# EasyEDA Pro project Project-File_Cpeedo-mk5.epro, schematic Schematic1

## Sheets
1 Cellular: Board Name: Board1; Create Date: 2025-12-05; Page Name: Cellular; Project Name: Speedo_1; Schematic Name: Schematic1; Update Date: 2026-03-03; Company: EasyEDA.com; Page Size: A4; Version: V1.0
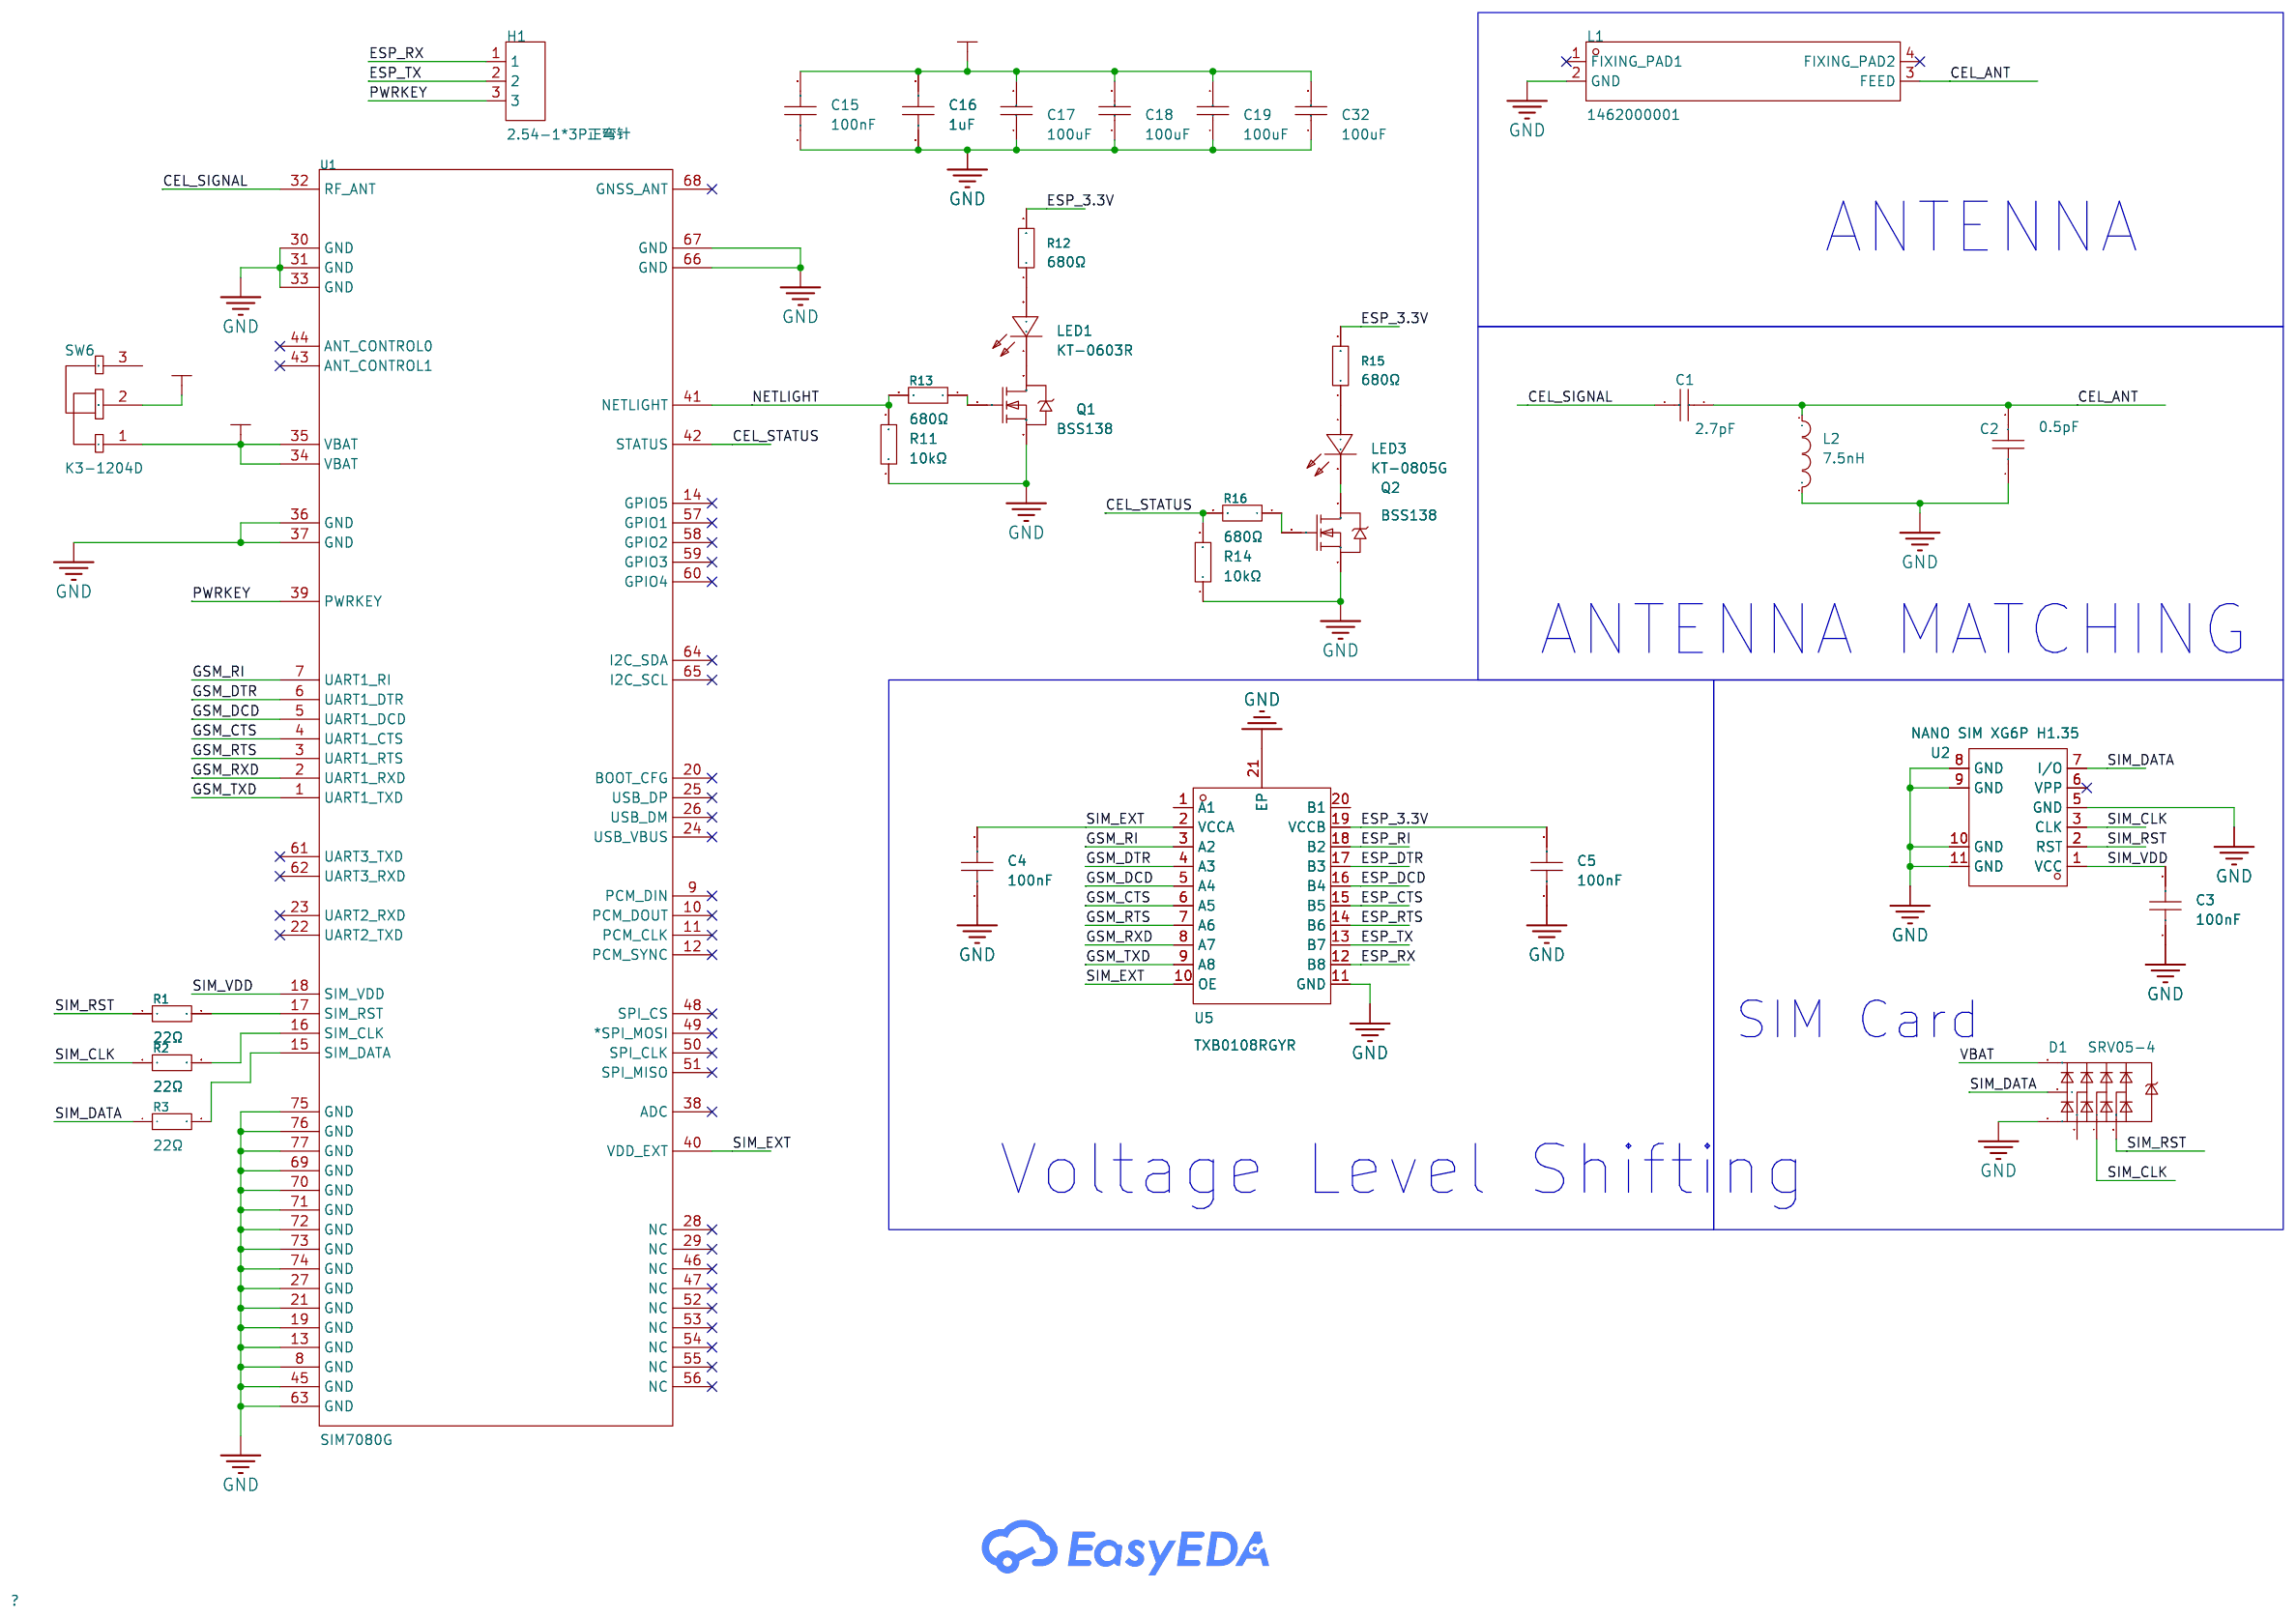
[diagram p0: Cellular]
2 STM32: Create Date: 2025-12-21; Page Name: STM32
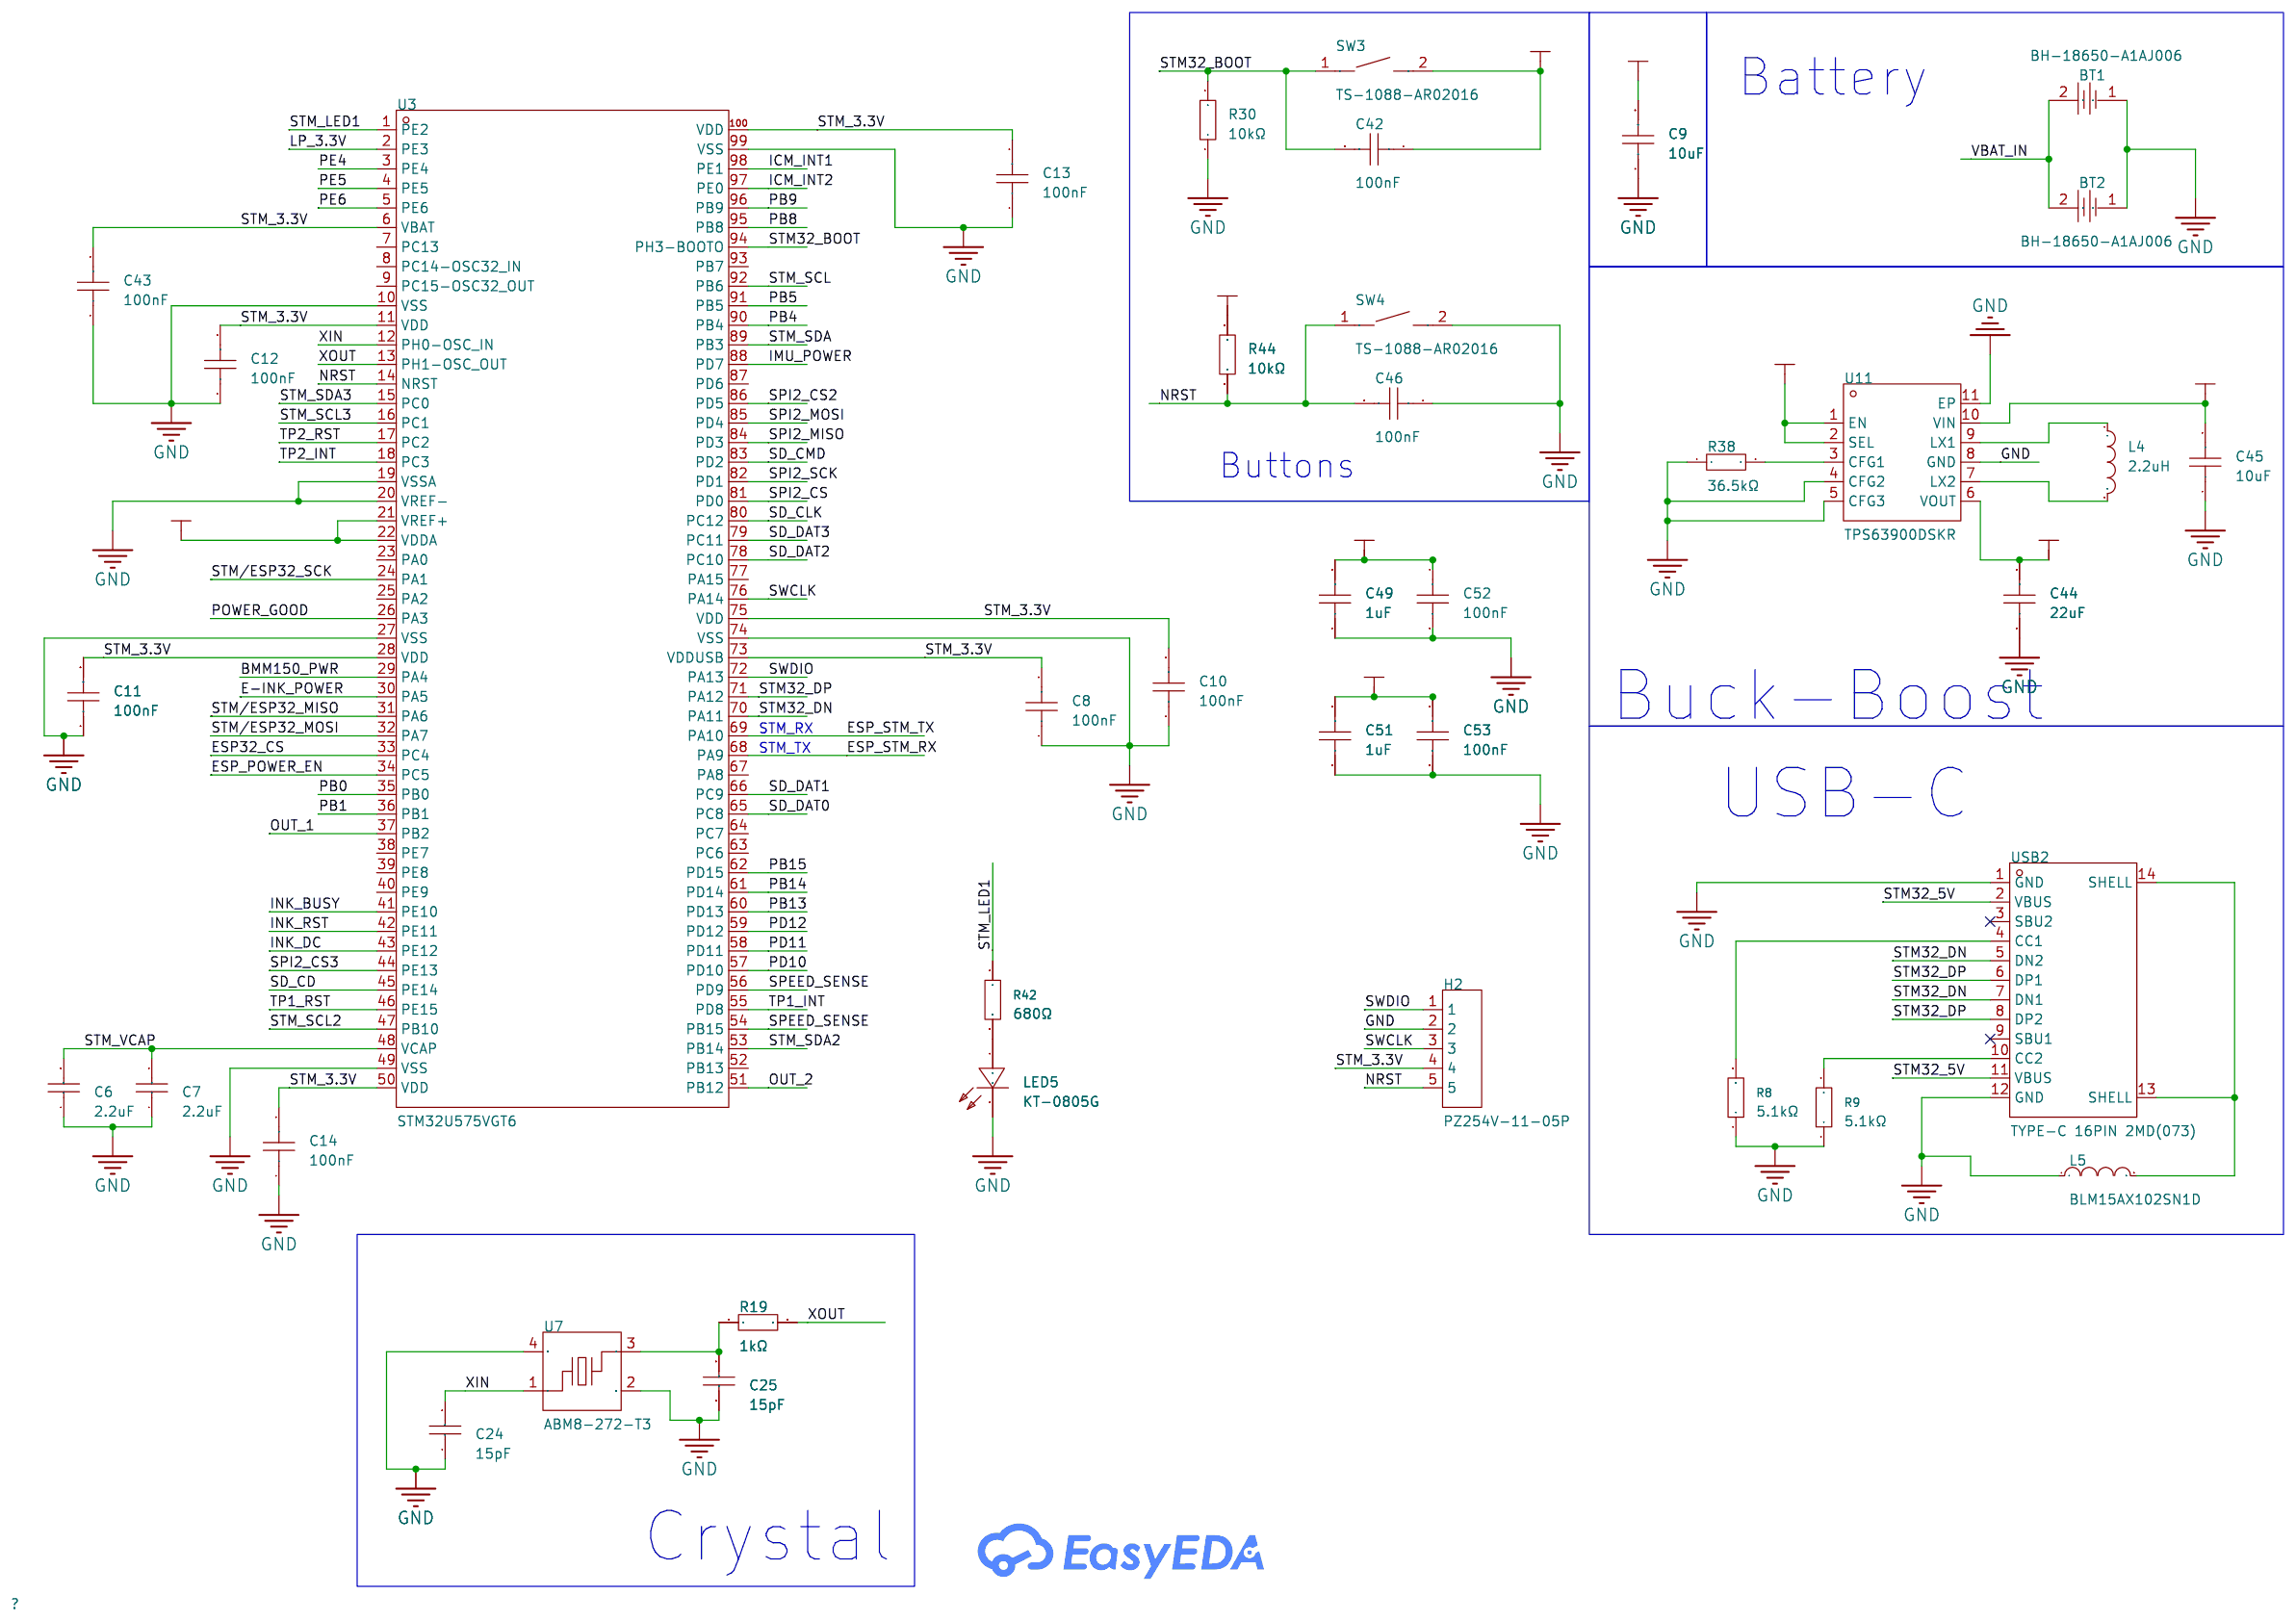
[diagram p1: STM32]
3 ESP32: Create Date: 2025-12-21; Page Name: ESP32; Update Date: 2026-03-02
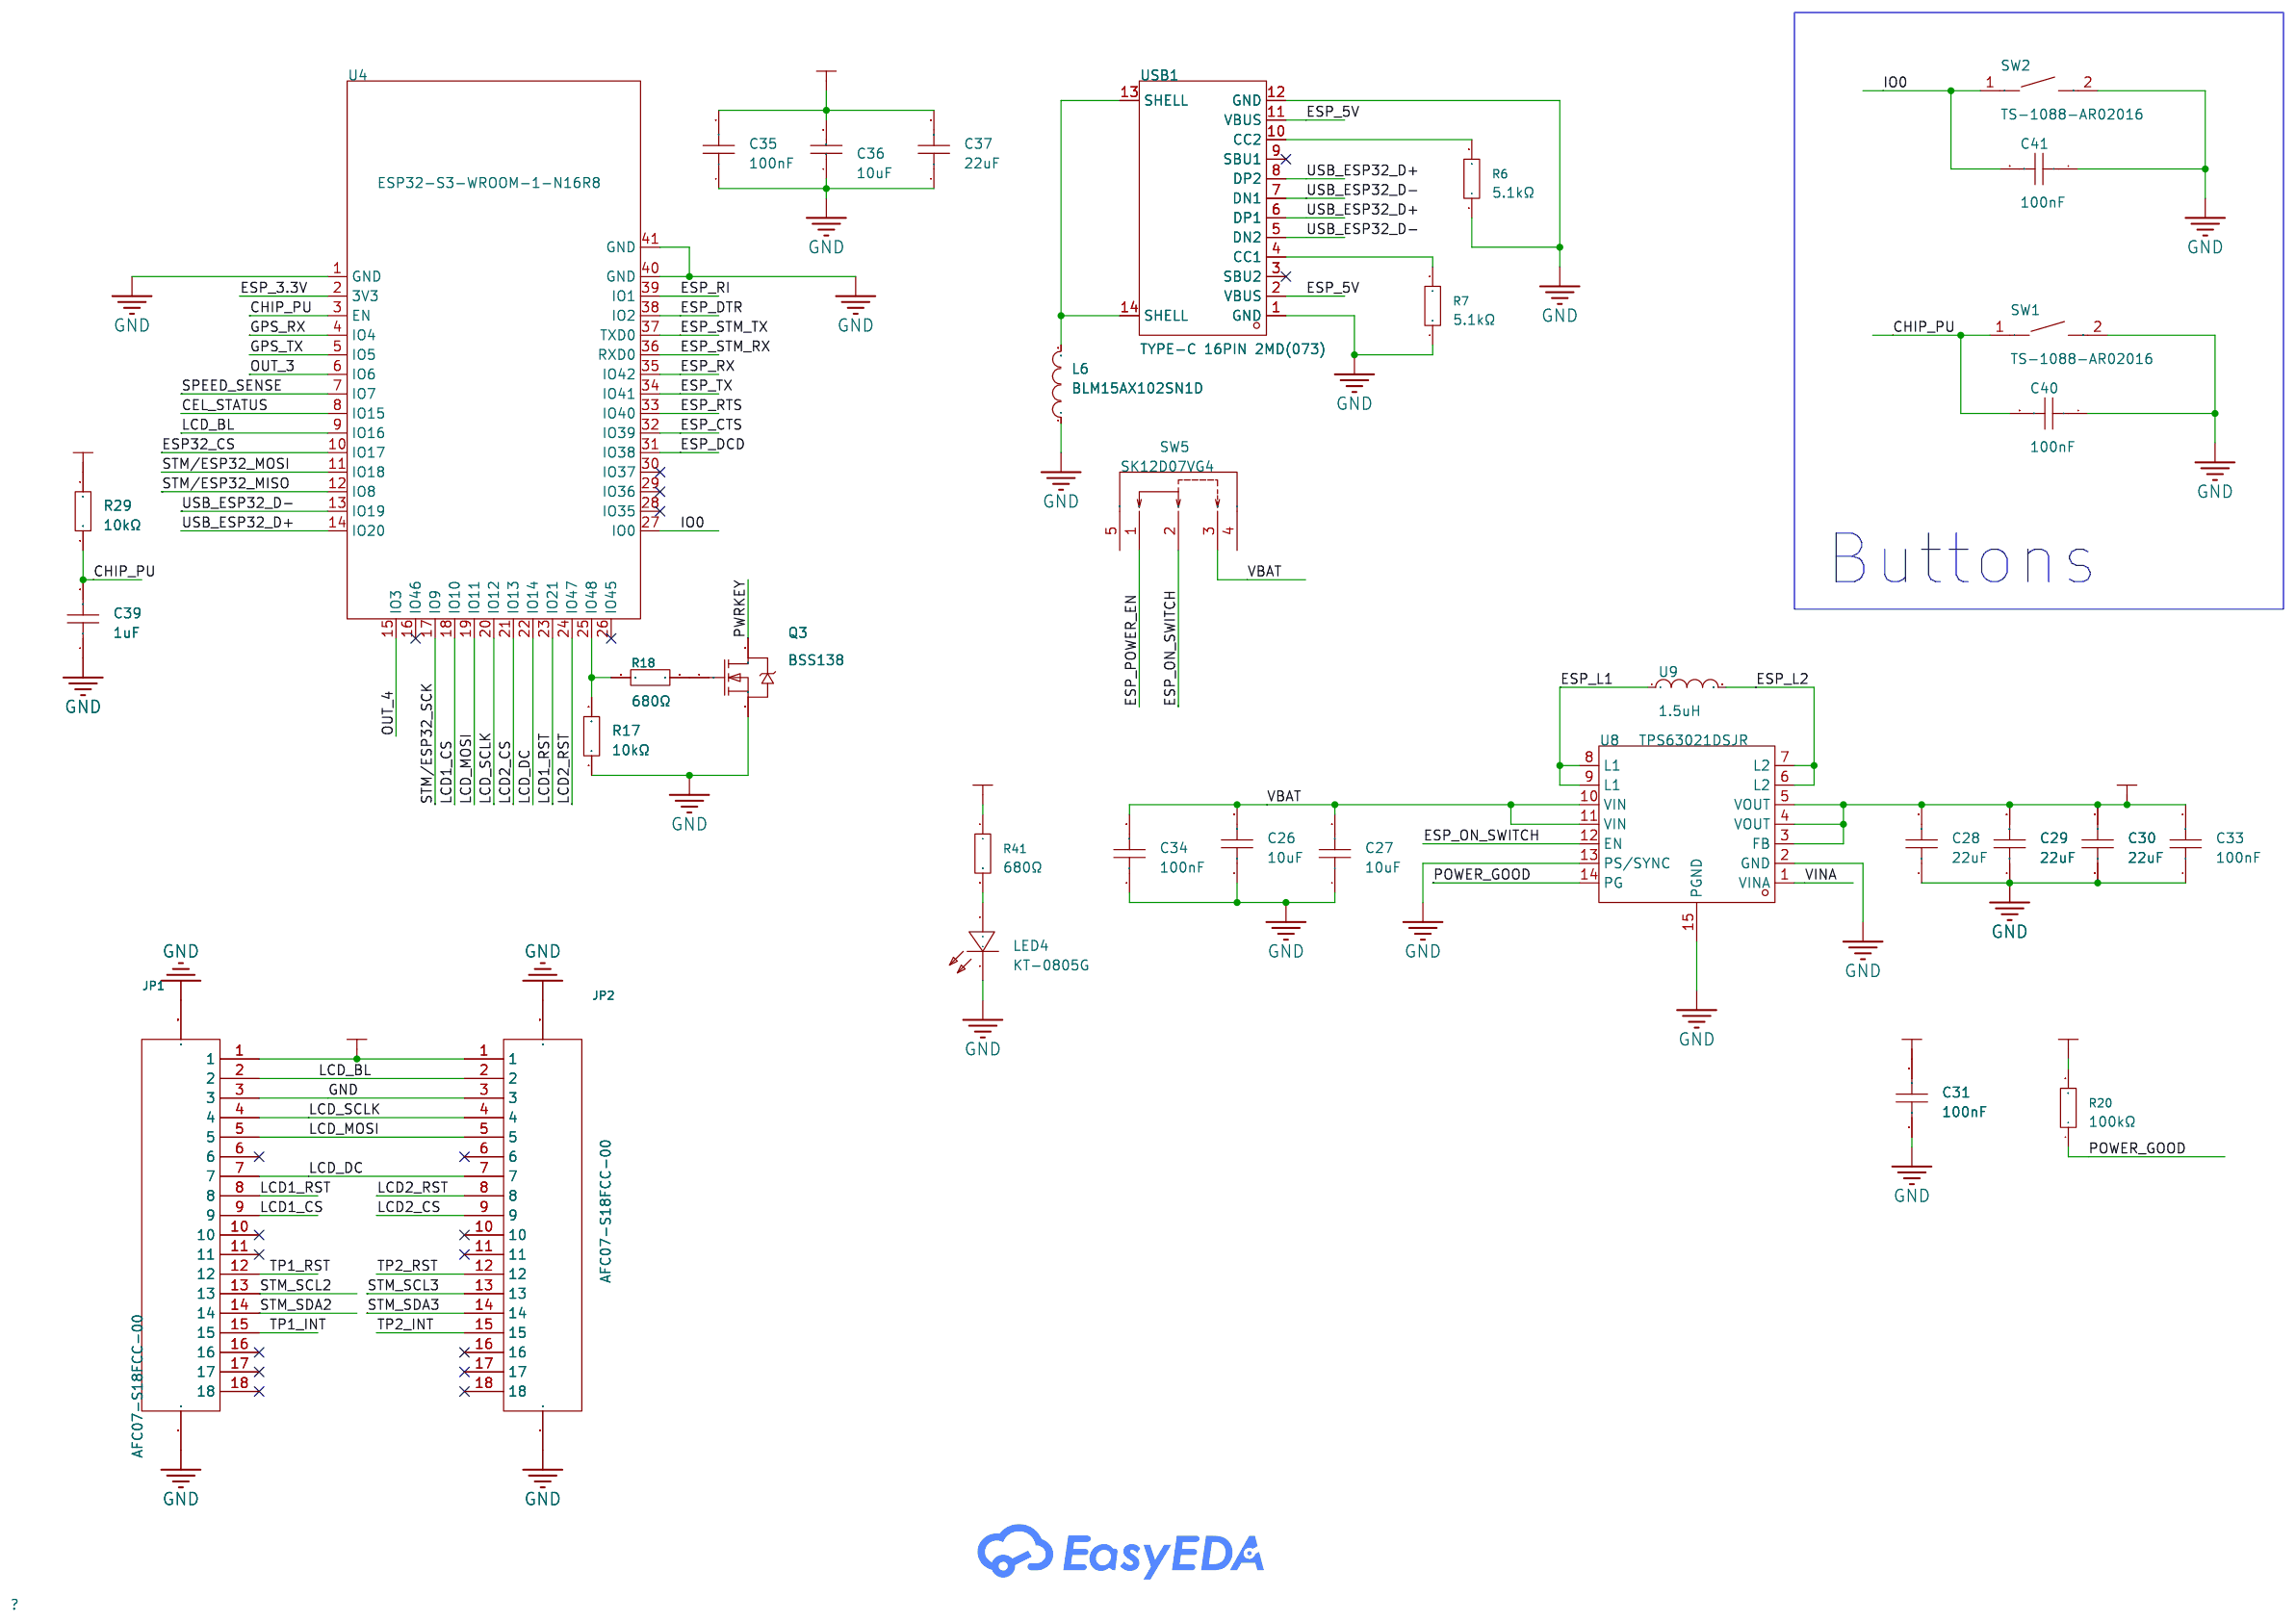
[diagram p2: ESP32]
4 GNSS / GPS: Create Date: 2025-12-22; Page Name: GNSS / GPS; Update Date: 2025-12-28
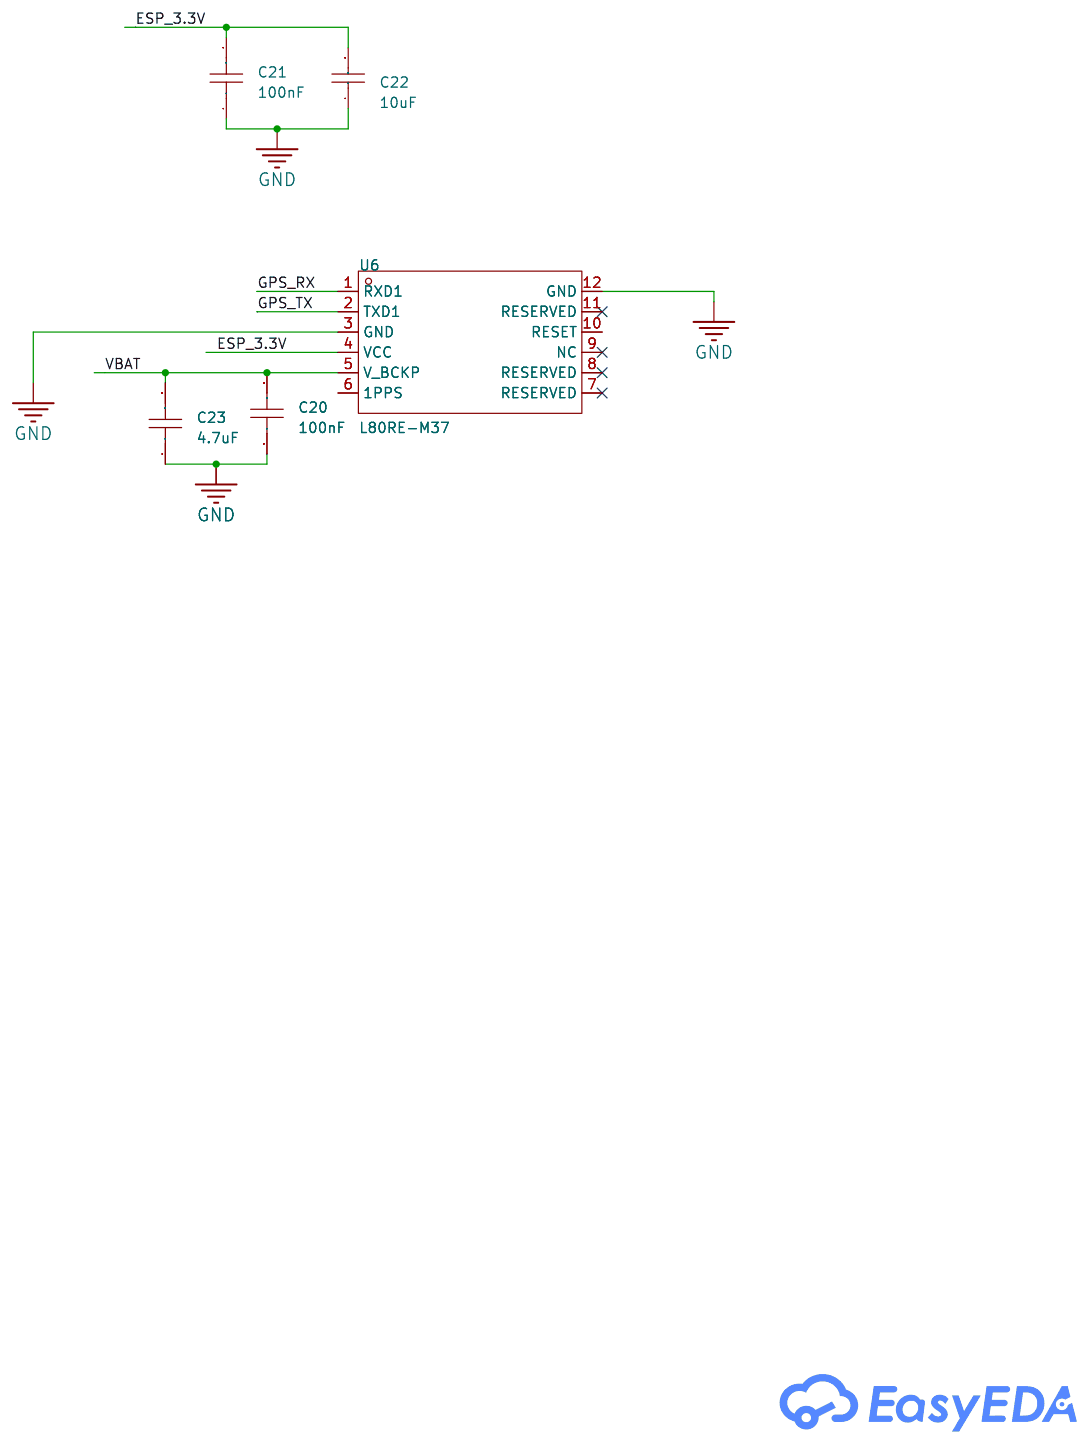
[diagram p3: GNSS / GPS]
5 STM32_Sensors: Create Date: 2025-12-24; Page Name: STM32_Sensors
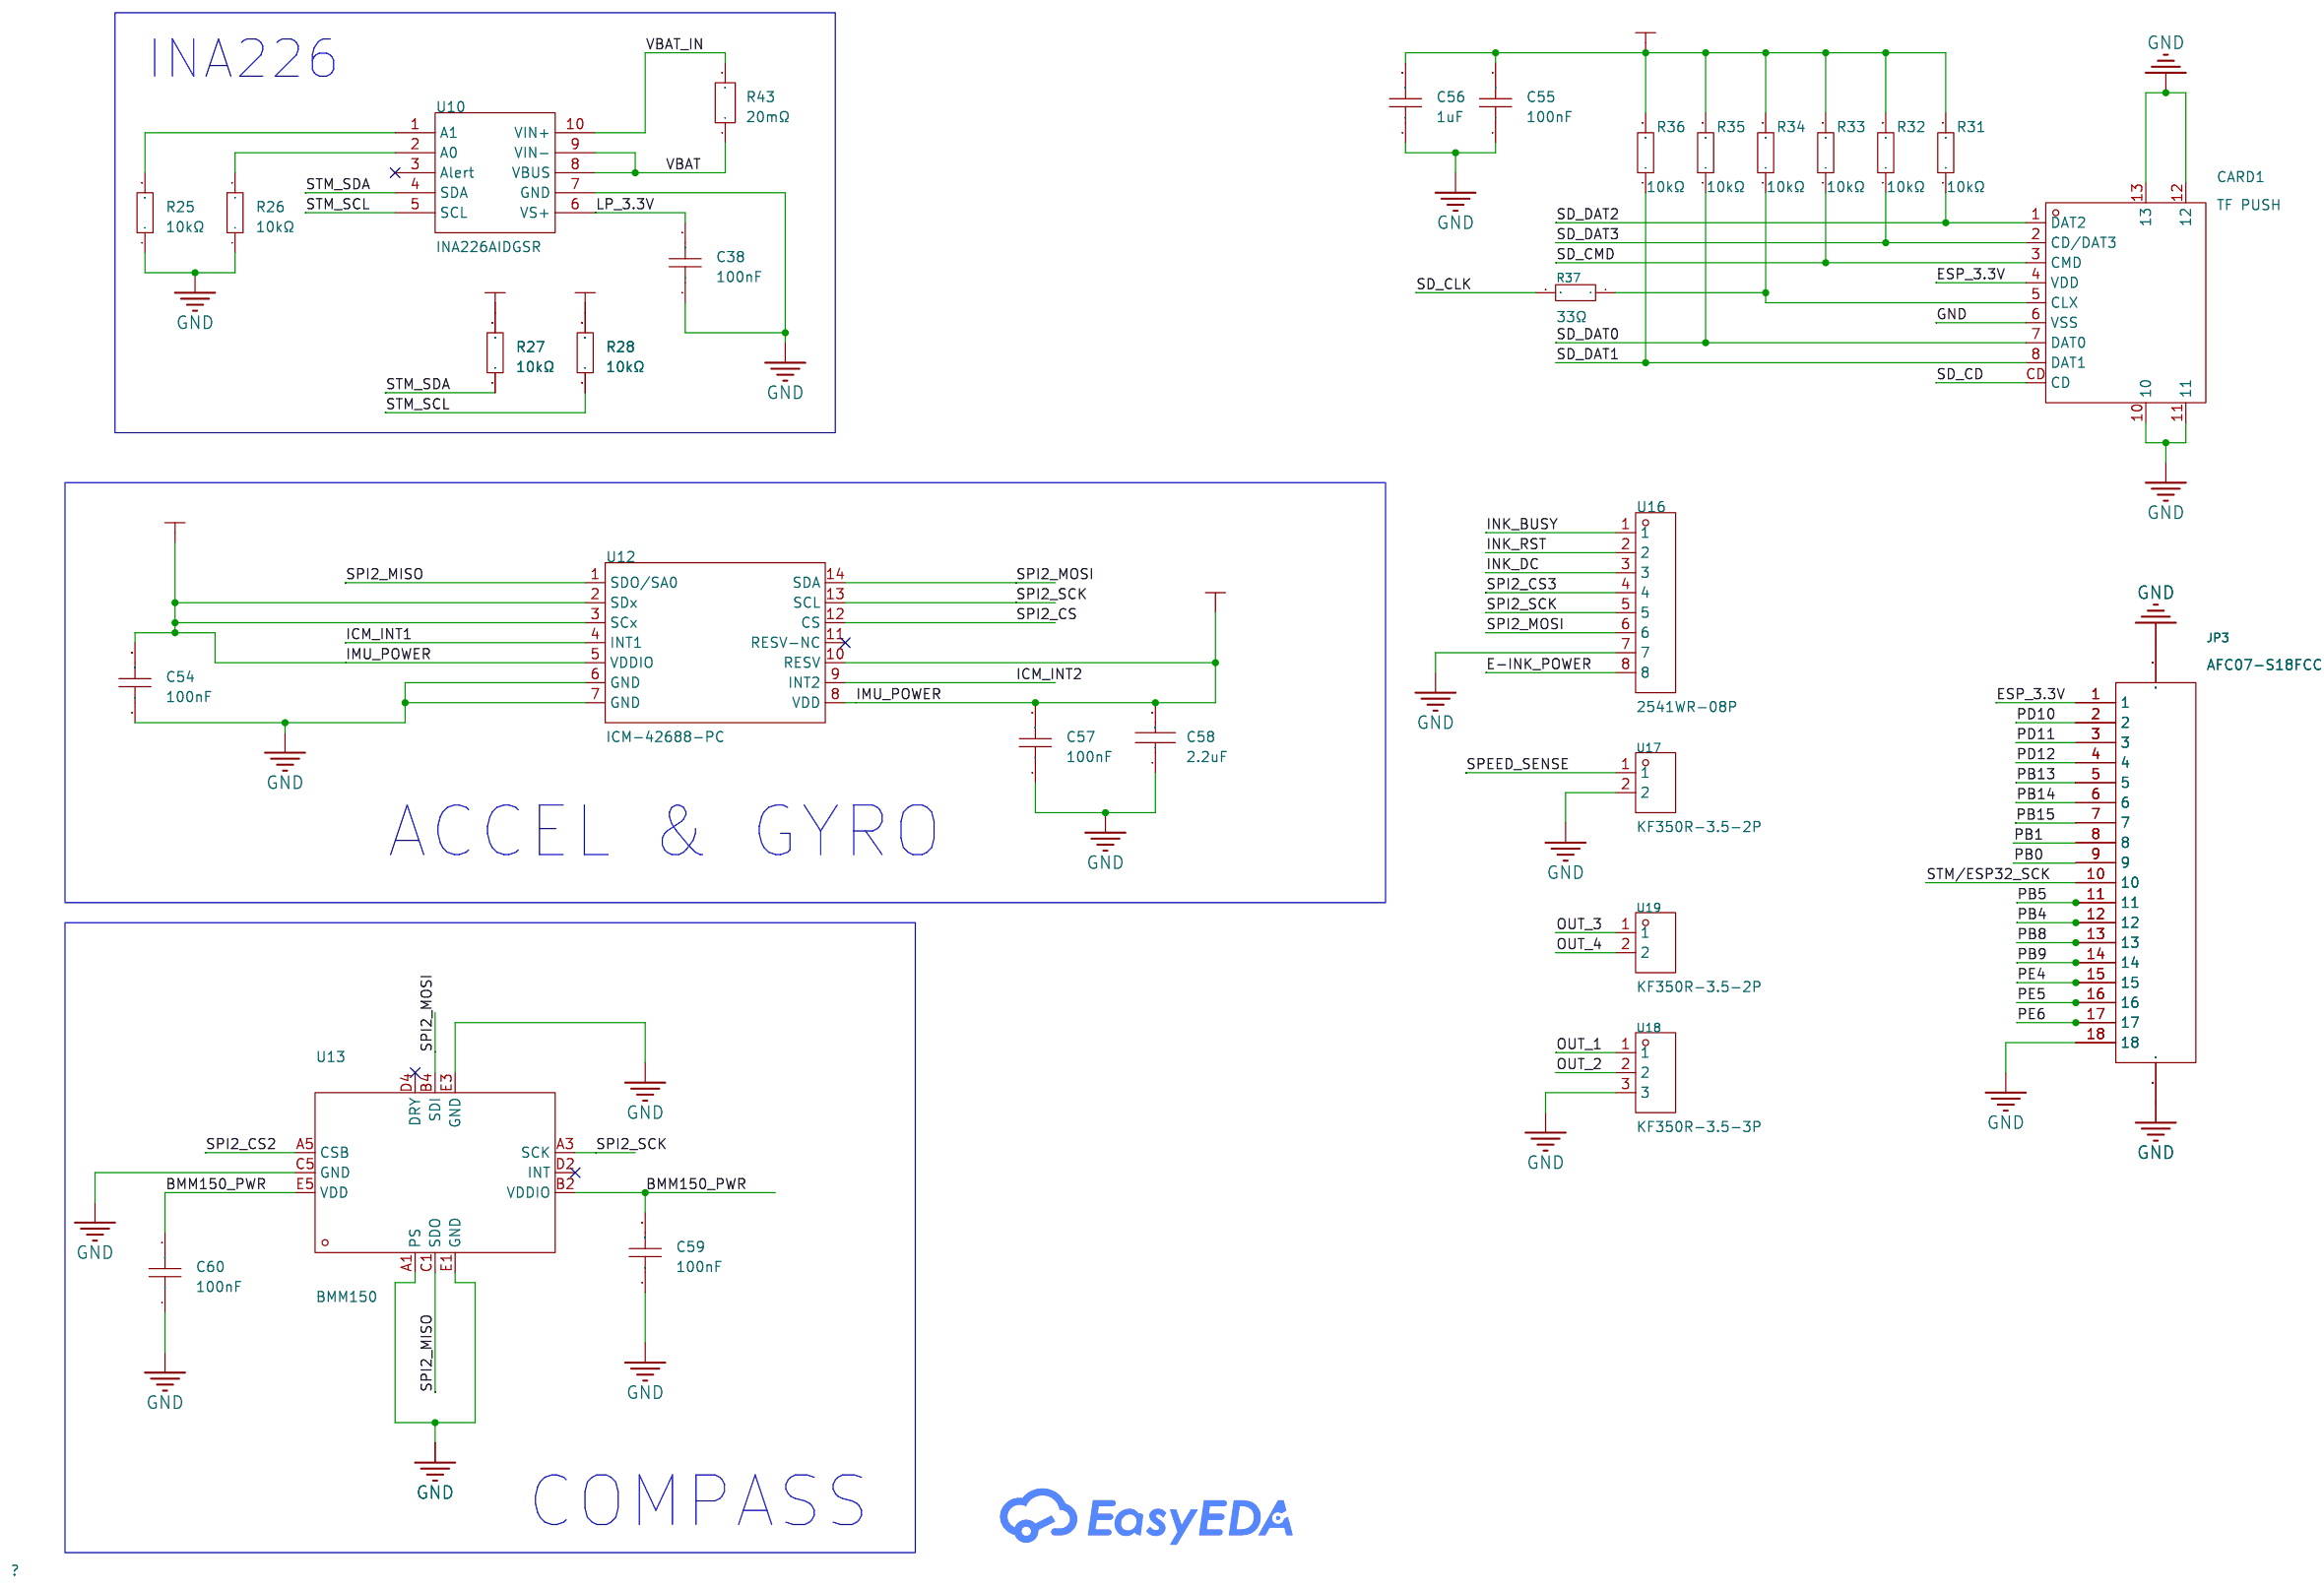
[diagram p4: STM32_Sensors]

## Parts
sheet Cellular
C1  2.7pF  [C0402]
C2  0.5pF  [C0402]
C3  100nF  [C0402]
C4  100nF  [C0402]
C5  100nF  [C0402]
C15  100nF  [C0402]
C16  1uF  [C0402]
C17  100uF  [C1206]
C18  100uF  [C1206]
C19  100uF  [C1206]
C32  100uF  [C1206]
D1  SRV05-4  [SOT-23-6_L2.9-W1.6-P0.95-LS2.8-BL-1]
H1  2.54-1*3P正弯针  [HDR-TH_3P-P2.54-H-M-BW7.2-P]  (no BOM)
L1  1462000001  [ANT-SMD_L40.0-W5.0_1462000001]
L2  7.5nH  [IND-SMD_L1.2-W0.6]
LED1  KT-0603R  [LED0603-RD]
LED3  KT-0805G  [LED0805-R-RD]
Q1  BSS138  [SOT-23-3_L2.9-W1.6-P1.90-LS2.8-BR]
Q2  BSS138  [SOT-23-3_L2.9-W1.6-P1.90-LS2.8-BR]
R1  22Ω  [R0402]
R2  22Ω  [R0402]
R3  22Ω  [R0402]
R11  10kΩ  [R0402]
R12  680Ω  [R0603]
R13  680Ω  [R0603]
R14  10kΩ  [R0402]
R15  680Ω  [R0603]
R16  680Ω  [R0603]
SW6  K3-1204D  [SW-TH_K3-1204D]
U1  SIM7080G  [LCC-SMD_SIM7080G]
U2  NANO SIM XG6P H1.35  [SIM-SMD_NANO-SIM-XG6P-H1.35]
U5  TXB0108RGYR  [VQFN-20_L4.5-W3.5-P0.50-BL-EP]
sheet ESP32
C26  10uF  [C0603]
C27  10uF  [C0603]
C28  22uF  [C0603]
C29  22uF  [C0603]
C30  22uF  [C0603]
C31  100nF  [C0402]
C33  100nF  [C0402]
C34  100nF  [C0402]
C35  100nF  [C0402]
C36  10uF  [C0402]
C37  22uF  [C0603]
C39  1uF  [C0402]
C40  100nF  [C0402]
C41  100nF  [C0402]
JP1  AFC07-S18FCC-00  [FPC-SMD_AFC07-S18FCC-00]
JP2  AFC07-S18FCC-00  [FPC-SMD_AFC07-S18FCC-00]
L6  BLM15AX102SN1D  [L0402]
LED4  KT-0805G  [LED0805-R-RD]
Q3  BSS138  [SOT-23-3_L2.9-W1.6-P1.90-LS2.8-BR]
R6  5.1kΩ  [R0402]
R7  5.1kΩ  [R0402]
R17  10kΩ  [R0402]
R18  680Ω  [R0603]
R20  100kΩ  [R0402]
R29  10kΩ  [R0402]
R41  680Ω  [R0603]
SW1  TS-1088-AR02016  [SW-SMD_L3.9-W3.0-P4.45]
SW2  TS-1088-AR02016  [SW-SMD_L3.9-W3.0-P4.45]
SW5  SK12D07VG4  [SW-TH_SK12D07VG4-1]
U4  ESP32-S3-WROOM-1-N16R8  [WIRELM-SMD_ESP32-S3-WROOM-1]
U8  TPS63021DSJR  [VSON-14_L4.0-W3.0-P0.50-BL-EP_TI_DSJ]
U9  1.5uH  [IND-SMD_L3.0-W3.0_FTC303020D]
USB1  TYPE-C 16PIN 2MD(073)  [USB-C-SMD_TYPE-C-6PIN-2MD-073]
sheet GNSS / GPS
C20  100nF  [C0402]
C21  100nF  [C0402]
C22  10uF  [C0402]
C23  4.7uF  [C0402]
U6  L80RE-M37  [GPSM-SMD_12P-L16.0-W16.0-P2.54-BL]
sheet STM32
BT1  BH-18650-A1AJ006  [BAT-TH_BH-18650-A1AJ006]
BT2  BH-18650-A1AJ006  [BAT-TH_BH-18650-A1AJ006]
C6  2.2uF  [C0603]
C7  2.2uF  [C0603]
C8  100nF  [C0402]
C9  10uF  [C0603]
C10  100nF  [C0402]
C11  100nF  [C0402]
C12  100nF  [C0402]
C13  100nF  [C0402]
C14  100nF  [C0402]
C24  15pF  [C0603]
C25  15pF  [C0603]
C42  100nF  [C0402]
C43  100nF  [C0402]
C44  22uF  [C0603]
C45  10uF  [C0603]
C46  100nF  [C0402]
C49  1uF  [C0402]
C51  1uF  [C0402]
C52  100nF  [C0402]
C53  100nF  [C0402]
H2  PZ254V-11-05P  [HDR-TH_5P-P2.54-V-M]
L4  2.2uH  [L1008]
L5  BLM15AX102SN1D  [L0402]
LED5  KT-0805G  [LED0805-R-RD]
R8  5.1kΩ  [R0402]
R9  5.1kΩ  [R0402]
R19  1kΩ  [R0603]
R30  10kΩ  [R0402]
R38  36.5kΩ  [R0603]
R42  680Ω  [R0603]
R44  10kΩ  [R0402]
SW3  TS-1088-AR02016  [SW-SMD_L3.9-W3.0-P4.45]
SW4  TS-1088-AR02016  [SW-SMD_L3.9-W3.0-P4.45]
U3  STM32U575VGT6  [LQFP-100_L14.0-W14.0-P0.50-LS16.0-BL]
U7  ABM8-272-T3  [CRYSTAL-SMD_4P-L3.2-W2.5-BL]
U11  TPS63900DSKR  [WSON-10_L2.5-W2.5-W0.50-TL-EP]
USB2  TYPE-C 16PIN 2MD(073)  [USB-C-SMD_TYPE-C-6PIN-2MD-073]
sheet STM32_Sensors
C38  100nF  [C0402]
C54  100nF  [C0402]
C55  100nF  [C0402]
C56  1uF  [C0402]
C57  100nF  [C0402]
C58  2.2uF  [C0402]
C59  100nF  [C0402]
C60  100nF  [C0402]
CARD1  TF PUSH  [TF-SMD_TF-PUSH]
JP3  AFC07-S18FCC-00  [FPC-SMD_AFC07-S18FCC-00]
R25  10kΩ  [R0402]
R26  10kΩ  [R0402]
R27  10kΩ  [R0402]
R28  10kΩ  [R0402]
R31  10kΩ  [R0402]
R32  10kΩ  [R0402]
R33  10kΩ  [R0402]
R34  10kΩ  [R0402]
R35  10kΩ  [R0402]
R36  10kΩ  [R0402]
R37  33Ω  [R0402]
R43  20mΩ  [RES-SMD_L6.4-W3.2-R2512]
U10  INA226AIDGSR  [MSOP-10_L3.0-W3.0-P0.50-LS5.0-BL]
U12  ICM-42688-PC  [LGA-14_L3.0-W2.5-P0.50-TL]
U13  BMM150  [WLCSP-12_L1.6-W1.6_BMM150]
U16  2541WR-08P  [HDR-TH_8P-P2.54-H-M-W10.4]
U17  KF350R-3.5-2P  [CONN-TH_P3.50_KF396R-3.5-2P]
U18  KF350R-3.5-3P  [CONN-TH_3P-P3.50_KF396R-3.5-3P]
U19  KF350R-3.5-2P  [CONN-TH_P3.50_KF396R-3.5-2P]

## Library data of the parts
C1 = 0402CG2R7C500NT: Capacitance: Voltage Rated: Temperature Coefficient:; LCSC Part Name: 2.7pF 50V; Supplier Part: C1561; Manufacturer: FH(风华); Supplier Footprint: 0402; JLCPCB Part Class: Extended Part; Datasheet: https://atta.szlcsc.com/upload/public/pdf/source/20200305/C486355_26A10D38EF8C2A5C37091D0039909270.pdf; Supplier: LCSC
C2 = 0402CG0R5B500NT: Capacitance:0.5pF Voltage Rating:50V Temperature Coefficient:C0G; LCSC Part Name: ±0.1pF 0.5pF 50V; Supplier Part: C285052; Manufacturer: FH(风华); Supplier Footprint: 0402; JLCPCB Part Class: Extended Part; Datasheet: https://atta.szlcsc.com/upload/public/pdf/source/20200305/C486355_26A10D38EF8C2A5C37091D0039909270.pdf; Supplier: LCSC; Voltage Rating: 50V; Temperature Coefficient: C0G
C3-C5 C8 C10-C15 C20 C21 C31 C33-C35 C38 C40-C43 C46 C52-C55 C57 C59 C60 = CL05B104KB54PNC: Capacitance:100nF Tolerance:±10% Tolerance:±10% Voltage Rating:50V Temperature Coefficient:X7R; LCSC Part Name: 100nF ±10% 50V; Supplier Part: C307331; Manufacturer: SAMSUNG(三星); Supplier Footprint: 0402; JLCPCB Part Class: Basic Part; Datasheet: https://item.szlcsc.com/datasheet/CL05B104KB54PNC/291005.html; Supplier: LCSC; Tolerance: ±10%; Voltage Rating: 50V; Temperature Coefficient: X7R
C16 C39 C49 C51 C56 = CL05A105KA5NQNC: Capacitance:1uF Tolerance:±10% Tolerance:±10% Voltage Rating:25V Temperature Coefficient:X5R; LCSC Part Name: 1uF ±10% 25V; Supplier Part: C52923; Manufacturer: SAMSUNG(三星); Supplier Footprint: 0402; JLCPCB Part Class: Basic Part; Datasheet: https://item.szlcsc.com/datasheet/CL05A105KA5NQNC/53938.html; Supplier: LCSC; Tolerance: ±10%; Voltage Rating: 25V; Temperature Coefficient: X5R
C17-C19 C32 = CL31A107MQHNNNE: Capacitance:100uF Tolerance:±20% Tolerance:±20% Voltage Rating:6.3V Temperature Coefficient:X5R; LCSC Part Name: 100uF ±20% 6.3V; Supplier Part: C15008; Manufacturer: SAMSUNG(三星); Supplier Footprint: 1206; JLCPCB Part Class: Basic Part; Datasheet: https://item.szlcsc.com/datasheet/CL31A107MQHNNNE/15681.html; Supplier: LCSC; Tolerance: ±20%; Voltage Rating: 6.3V; Temperature Coefficient: X5R
D1 = SRV05-4_C7420376: Polarity:Unidirectional Reverse Stand-Off Voltage (Vrwm):5V Clamping Voltage:12.5V Peak Pulse Current (Ipp):5A Peak Pulse Power Dissipation (Ppp):75W Voltage - Breakdown:6V Reverse Leakage Current (Ir):5uA Number of Channels:5 Operating Temperature:-55℃~+; LCSC Part Name: 丝印 V05 双向ESD 5V截止 峰值浪涌电流：5A; Supplier Part: C7420376; Manufacturer: R+O(宏嘉诚); Supplier Footprint: SOT-23-6L; JLCPCB Part Class: Extended Part; Datasheet: https://item.szlcsc.com/datasheet/SRV05-4/8397198.html; Supplier: LCSC; Polarity: Unidirectional; Reverse Stand-Off Voltage (Vrwm): 5V; Clamping Voltage: 12.5V; Peak Pulse Current (Ipp): 5A; Peak Pulse Power Dissipation (Ppp): 75W; Voltage - Breakdown: 6V; Reverse Leakage Current (Ir): 5uA; Number of Channels: 5; Operating Temperature: -55℃~+155℃; level of protection: IEC 61000-4-2；IEC 61000-4-5; Type: ESD; Junction Capacitance: 0.5pF；1pF
H1 = 2.54-1*3P正弯针: Pin Structure:1x3P Pitch:2.54mm Row Spacing:- Circluar Pins/Square Pins:Pin Header Mounting Type:Right Angle Number of Rows:1 Number of Pins:3P Current Rating:3A Voltage Rating (Max):- Length of Mating Pin:3mm Insulation Height:2.54mm Length of End Connec; LCSC Part Name: 1x3P 间距:2.54mm 方针 弯插; Supplier Part: C92159; Manufacturer: BOOMELE(博穆精密); Supplier Footprint: 弯插,P=2.54mm; JLCPCB Part Class: Extended Part; Datasheet: https://item.szlcsc.com/datasheet/2.54-1*3P%25E6%25AD%25A3%25E5%25BC%25AF%25E9%2592%2588/93349.html; Supplier: LCSC; Pin Structure: 1x3P; Pitch: 2.54mm; Circluar Pins/Square Pins: Pin Header; Mounting Type: Right Angle; Number of Rows: 1; Number of Pins: 3P; Current Rating: 3A; Length of Mating Pin: 3mm; Insulation Height: 2.54mm; Operating Temperature: -55℃~+105℃; Color: Black
L1 = 1462000001: Antenna Type:Chip Antenna Frequency(Center/Band):1.684GHz Bandwidth:1.002GHz Peak Gain:1.1dBi；4.5dBi Peak Gain:1.1dBi；4.5dBi Impedance:50Ω Power:2W Operating Temperature:-30℃~+85℃ Operating Temperature:-30℃~+85℃; Supplier Part: C3284456; Manufacturer: MOLEX; JLCPCB Part Class: Extended Part; Datasheet: https://www.molex.com/content/dam/molex/molex-dot-com/products/automated/en-us/salesdrawingpdf/146/146200/1462000001_sd.pdf?inline; Supplier: LCSC; Antenna Type: Chip Antenna; Frequency(Center/Band): 1.684GHz; Bandwidth: 1.002GHz; Peak Gain: 1.1dBi；4.5dBi; Impedance: 50Ω; Power: 2W; Operating Temperature: -30℃~+85℃
L2 = SCW1005C7N5JST: Inductance:7.5nH Tolerance:±5% Tolerance:±5% Current Rating:570mA Current - Saturation (Isat):- DC Resistance(DCR):120mΩ Q @ Frequency:- Frequency - Self Resonant:- Ratings:-; LCSC Part Name: 7.5nH ±5%; Supplier Part: C330848; Manufacturer: Sunltech(顺磁); Supplier Footprint: 0402; JLCPCB Part Class: Extended Part; Datasheet: https://item.szlcsc.com/datasheet/SCW1005C7N5JST/310250.html; Supplier: LCSC; Tolerance: ±5%; Current Rating: 570mA; DC Resistance(DCR): 120mΩ
LED1 = KT-0603R: Emitted Color:Red Power Dissipation:- Forward Current:- Dominant Wavelength:- Dominant Wavelength:- Peak Wavelength:- Diode Configuration:- Lens Color:- Color Temperature:- Color Temperature:- Viewing Angle:- Mounting Sytle:- Operating Temperature:-40℃~+8; LCSC Part Name: 0603 红灯 高亮; Supplier Part: C2286; Manufacturer: KENTO; Supplier Footprint: 0603; JLCPCB Part Class: Basic Part; Datasheet: https://atta.szlcsc.com/upload/public/pdf/source/20160616/1466072038404.pdf; Supplier: LCSC; Emitted Color: Red; Operating Temperature: -40℃~+85℃
LED3-LED5 = KT-0805G: Lamp Holder Type:- Illumination Color:Emerald Green Voltage - Forward(Vf):2.6V~3.1V Voltage - Forward(Vf):2.6V~3.1V Power(Watts):100mW Forward Current:5mA Wavelength - Dominant:513nm~528nm Wavelength - Dominant:513nm~528nm Peak Wavelength:525nm Diode Conf; LCSC Part Name: 0805 翠绿 高亮; Supplier Part: C2297; Manufacturer: KENTO; Supplier Footprint: 0805; JLCPCB Part Class: Basic Part; Datasheet: https://item.szlcsc.com/datasheet/KT-0805G/2670.html; Supplier: LCSC; Illumination Color: Emerald Green; Voltage - Forward(Vf): 2.6V~3.1V; Power(Watts): 100mW; Forward Current: 5mA; Wavelength - Dominant: 513nm~528nm; Peak Wavelength: 525nm; Luminous Intensity: 430mcd; Viewing Angle: 120°; Operating Temperature: -40℃~+85℃
Q1-Q3 = BSS138_C52895: Type:1 N-Channel Drain Source Voltage (Vdss): Continuous Drain Current (Id):220mA Drain Source On Resistance (RDS(on)@Vgs,Id):3.5Ω@10V,0.22A Power Dissipation (Pd):360mW Gate Threshold Voltage (Vgs(th)@Id):1.5V@1mA Total Gate Charge (Qg@Vgs):2.4nC@25V Inp; LCSC Part Name: 1个N沟道 耐压:50V 电流:220mA; Supplier Part: C52895; Manufacturer: onsemi(安森美); Supplier Footprint: SOT-23; JLCPCB Part Class: Extended Part; Datasheet: https://atta.szlcsc.com/upload/public/pdf/source/20170412/1491969107299.pdf; Supplier: LCSC; Type: 1 N-Channel; Continuous Drain Current (Id): 220mA; Drain Source On Resistance (RDS(on)@Vgs,Id): 3.5Ω@10V,0.22A; Power Dissipation (Pd): 360mW; Gate Threshold Voltage (Vgs(th)@Id): 1.5V@1mA; Total Gate Charge (Qg@Vgs): 2.4nC@25V; Input Capacitance (Ciss@Vds): 27pF@25V; Reverse Transfer Capacitance (Crss@Vds): 6pF; Operating Temperature: -55℃~+150℃
R1-R3 = 0402WGF220JTCE: Type:Thick Film Resistors Resistance:22Ω Tolerance:±1% Tolerance:±1% Power(Watts): Overload Voltage (Max): Temperature Coefficient:±100ppm/℃ Temperature Coefficient:±100ppm/℃ Operating Temperature Range:-55℃~+155℃ Operating Temperature Range:-55℃~+155℃; LCSC Part Name: 22Ω ±1% 62.5mW 厚膜电阻; Supplier Part: C25092; Manufacturer: UNI-ROYAL(厚声); Supplier Footprint: 0402; JLCPCB Part Class: Basic Part; Datasheet: https://atta.szlcsc.com/upload/public/pdf/source/20200306/C422600_1E6D84923E4A46A82E41ADD87F860B5C.pdf; Supplier: LCSC; Type: Thick Film Resistors; Tolerance: ±1%; Temperature Coefficient: ±100ppm/℃; Operating Temperature Range: -55℃~+155℃
R11 R14 R17 R25-R36 R44 = 0402WGF1002TCE: Type:Thick Film Resistor Resistance:10kΩ Tolerance:±1% Tolerance:±1% Power(Watts):62.5mW Voltage-Supply(Max):50V Temperature Coefficient:±100ppm/℃ Temperature Coefficient:±100ppm/℃ Operating Temperature:-55℃~+155℃ Operating Temperature:-55℃~+155℃; LCSC Part Name: 10kΩ ±1% 62.5mW 厚膜电阻; Supplier Part: C25744; Manufacturer: UNI-ROYAL(厚声); Supplier Footprint: 0402; JLCPCB Part Class: Basic Part; Datasheet: https://item.szlcsc.com/datasheet/0402WGF1002TCE/26487.html; Supplier: LCSC; Type: Thick Film Resistor; Tolerance: ±1%; Power(Watts): 62.5mW; Voltage-Supply(Max): 50V; Temperature Coefficient: ±100ppm/℃; Operating Temperature: -55℃~+155℃
R12 R13 R15 R16 R18 R41 R42 = 0603WAF6800T5E: Type:Thick Film Resistors Resistance: Tolerance:±1% Tolerance:±1% Power(Watts): Overload Voltage (Max): Temperature Coefficient:±100ppm/℃ Temperature Coefficient:±100ppm/℃ Operating Temperature Range:-55℃~+155℃ Operating Temperature Range:-55℃~+155℃; LCSC Part Name: 680Ω ±1% 100mW 厚膜电阻; Supplier Part: C23228; Manufacturer: UNI-ROYAL(厚声); Supplier Footprint: 0603; JLCPCB Part Class: Basic Part; Datasheet: https://atta.szlcsc.com/upload/public/pdf/source/20200306/C422600_1E6D84923E4A46A82E41ADD87F860B5C.pdf; Supplier: LCSC; Type: Thick Film Resistors; Tolerance: ±1%; Temperature Coefficient: ±100ppm/℃; Operating Temperature Range: -55℃~+155℃
SW6 = K3-1204D: Circuit:SPDT Actuator Style:- Termination Style:PC Pin Length:10mm Width:2.5mm Switch Height:6mm Mounting Type:Through Hole Actuator Color:Red Current Rating:5A Voltage Rating:120V Life:50,000 Cycles Operating Temperature:-25℃~+80℃ Operating Temperature:-; LCSC Part Name: 直插双档 滑动开关; Supplier Part: C145861; Manufacturer: 韩国韩荣; Supplier Footprint: 插件,10x2.5mm; JLCPCB Part Class: Extended Part; Datasheet: https://item.szlcsc.com/datasheet/K3-1204D/157193.html; Supplier: LCSC; Circuit: SPDT; Termination Style: PC Pin; Length: 10mm; Width: 2.5mm; Switch Height: 6mm; Mounting Type: Through Hole; Actuator Color: Red; Current Rating: 5A; Voltage Rating: 120V; Life: 50,000 Cycles; Operating Temperature: -25℃~+80℃
U1 = SIM7080G: LCSC Part Name: 多频段CAT-M和NB-IoT模块; Supplier Part: C2943992; Manufacturer: SIMCOM(芯讯通无线科技); Supplier Footprint: SMD,15.7x17.6mm; JLCPCB Part Class: Extended Part; Datasheet: https://item.szlcsc.com/datasheet/SIM7080G/3329189.html; Supplier: LCSC
U2 = NANO SIM XG6P H1.35: Card Connection Mode:Hinged Lid Card Type:Nano-SIM Card Connector Type:Connector and Ejector Card Detection:- Supplementary Features:- Height Above Board:1.45mm Operating Temperature:-20℃~+85℃ Operating Temperature:-20℃~+85℃; LCSC Part Name: 翻盖式 NanoSIM卡 卡座; Supplier Part: C7529386; Manufacturer: SHOU HAN(首韩); Supplier Footprint: SMD; JLCPCB Part Class: Extended Part; Datasheet: https://item.szlcsc.com/datasheet/NANO%2520SIM%2520XG6P%2520H1.35/8629773.html; Supplier: LCSC; Card Connection Mode: Hinged Lid; Card Type: Nano-SIM Card; Connector Type: Connector and Ejector; Height Above Board: 1.45mm; Operating Temperature: -20℃~+85℃
U5 = TXB0108RGYR: Channel Type:Bidirectional Input Signal:- Output Signal:- Data Rate:100Mbps Voltage - Supply(VCCA):1.2V~3.6V Voltage - Supply(VCCA):1.2V~3.6V Voltage - Supply(VCCB):1.65V~5.5V Voltage - Supply(VCCB):1.65V~5.5V Number of Circuits:1 Number of Circuits:8 Out; LCSC Part Name: 100Mbps 8位双向电平转换器; Supplier Part: C194701; Manufacturer: TI(德州仪器); Supplier Footprint: VQFN-20-EP(3.5x4.5); JLCPCB Part Class: Extended Part; Datasheet: https://item.szlcsc.com/datasheet/TXB0108RGYR/238015.html; Supplier: LCSC; Channel Type: Bidirectional; Data Rate: 100Mbps; Voltage - Supply(VCCA): 1.2V~3.6V; Voltage - Supply(VCCB): 1.65V~5.5V; Number of Circuits: 8; Output Type: Tri-State; Operating Temperature: -40℃~+85℃; Features: Automatic Direction Detection
C9 C26 C27 C45 = CL10A106KP8NNNC: Capacitance:10uF Tolerance:±10% Tolerance:±10% Voltage Rating:10V Temperature Coefficient:X5R; LCSC Part Name: 10uF ±10% 10V; Supplier Part: C19702; Manufacturer: SAMSUNG(三星); Supplier Footprint: 0603; JLCPCB Part Class: Basic Part; Datasheet: https://item.szlcsc.com/datasheet/CL10A106KP8NNNC/20411.html; Supplier: LCSC; Tolerance: ±10%; Voltage Rating: 10V; Temperature Coefficient: X5R
C28-C30 C37 C44 = CL10A226MQ8NRNC: Capacitance:22uF Tolerance:±20% Tolerance:±20% Voltage Rating:6.3V Temperature Coefficient:X5R; LCSC Part Name: 22uF ±20% 6.3V; Supplier Part: C59461; Manufacturer: SAMSUNG(三星); Supplier Footprint: 0603; JLCPCB Part Class: Basic Part; Datasheet: https://item.szlcsc.com/datasheet/CL10A226MQ8NRNC/60514.html; Supplier: LCSC; Tolerance: ±20%; Voltage Rating: 6.3V; Temperature Coefficient: X5R
C22 C36 = CL05A106MQ5NUNC: Capacitance:10uF Tolerance:±20% Tolerance:±20% Voltage Rating:6.3V Temperature Coefficient:X5R; LCSC Part Name: 10uF ±20% 6.3V; Supplier Part: C15525; Manufacturer: SAMSUNG(三星); Supplier Footprint: 0402; JLCPCB Part Class: Basic Part; Datasheet: https://item.szlcsc.com/datasheet/CL05A106MQ5NUNC/16204.html; Supplier: LCSC; Tolerance: ±20%; Voltage Rating: 6.3V; Temperature Coefficient: X5R
JP1-JP3 = AFC07-S18FCC-00: Locking Feature:Slide Lock Contact Type:Bottom Contact Number of Contacts:18P Pitch:0.5mm Mounting Type:Surface Mount, Right Angle FFC, FCB Thickness:0.3mm FFC, FCB Thickness:0.3mm Height Above Board:2mm Contact Material:Phosphor Bronze Contact Plating:Ti; LCSC Part Name: 抽屉式 下接 P数:18P 间距:0.5mm; Supplier Part: C11054; Manufacturer: JS(钜硕电子); Supplier Footprint: SMD,P=0.5mm,卧贴; JLCPCB Part Class: Extended Part; Datasheet: https://item.szlcsc.com/datasheet/AFC07-S18FCC-00/11601.html; Supplier: LCSC; Locking Feature: Slide Lock; Contact Type: Bottom Contact; Number of Contacts: 18P; Pitch: 0.5mm; Mounting Type: Surface Mount, Right Angle; FFC, FCB Thickness: 0.3mm; Height Above Board: 2mm; Contact Material: Phosphor Bronze; Contact Plating: Tin; Operating Temperature: -25℃~+85℃; Rated Voltage (Max): 50V; Current Rating (Max): 400mA
L5 L6 = BLM15AX102SN1D: Impedance @ Frequency:1kΩ@100MHz Tolerance:±25% Tolerance:±25% DC Resistance(DCR):490mΩ Current Rating:350mA Number of Circuits:1 Operating Temperature:-55℃~+125℃ Operating Temperature:-55℃~+125℃; LCSC Part Name: 1 1kΩ@100MHz; Supplier Part: C85815; Manufacturer: muRata(村田); Supplier Footprint: 0402; JLCPCB Part Class: Extended Part; Datasheet: https://item.szlcsc.com/datasheet/BLM15AX102SN1D/86991.html; Supplier: LCSC; Impedance @ Frequency: 1kΩ@100MHz; Tolerance: ±25%; DC Resistance(DCR): 490mΩ; Current Rating: 350mA; Number of Circuits: 1; Operating Temperature: -55℃~+125℃
R6-R9 = 0402WGF5101TCE: Type:Thick Film Resistor Resistance:5.1kΩ Tolerance:±1% Tolerance:±1% Power(Watts):62.5mW Voltage-Supply(Max):50V Temperature Coefficient:±100ppm/℃ Temperature Coefficient:±100ppm/℃ Operating Temperature:-55℃~+155℃ Operating Temperature:-55℃~+155℃; LCSC Part Name: 5.1kΩ ±1% 62.5mW 厚膜电阻; Supplier Part: C25905; Manufacturer: UNI-ROYAL(厚声); Supplier Footprint: 0402; JLCPCB Part Class: Basic Part; Datasheet: https://item.szlcsc.com/datasheet/0402WGF5101TCE/26648.html; Supplier: LCSC; Type: Thick Film Resistor; Tolerance: ±1%; Power(Watts): 62.5mW; Voltage-Supply(Max): 50V; Temperature Coefficient: ±100ppm/℃; Operating Temperature: -55℃~+155℃
R20 = 0402WGF1003TCE: Type:Thick Film Resistor Resistance:100kΩ Tolerance:±1% Tolerance:±1% Power(Watts):62.5mW Voltage-Supply(Max):50V Temperature Coefficient:±100ppm/℃ Temperature Coefficient:±100ppm/℃ Operating Temperature:-55℃~+155℃ Operating Temperature:-55℃~+155℃; LCSC Part Name: 100kΩ ±1% 62.5mW 厚膜电阻; Supplier Part: C25741; Manufacturer: UNI-ROYAL(厚声); Supplier Footprint: 0402; JLCPCB Part Class: Basic Part; Datasheet: https://item.szlcsc.com/datasheet/0402WGF1003TCE/26484.html; Supplier: LCSC; Type: Thick Film Resistor; Tolerance: ±1%; Power(Watts): 62.5mW; Voltage-Supply(Max): 50V; Temperature Coefficient: ±100ppm/℃; Operating Temperature: -55℃~+155℃
SW1-SW4 = TS-1088-AR02016: Circuit:SPST Actuator Style:Round Button Operating Force:1.6N Mounting Type:Surface Mount,Vertical Length:4mm Width:3mm Switch Height:2mm with Bracket:Without Bracket Contact Current:50mA Voltage Rating:12V Actuator/Cap Color:Black Termination Style:SMD(S; LCSC Part Name: 4*3*2mm 立贴 轻触开关; Supplier Part: C720477; Manufacturer: XUNPU(讯普); Supplier Footprint: SMD,4x3mm; JLCPCB Part Class: Basic Part; Datasheet: https://item.szlcsc.com/datasheet/TS-1088-AR02016/763484.html; Supplier: LCSC; Circuit: SPST; Actuator Style: Round Button; Operating Force: 1.6N; Mounting Type: Surface Mount,Vertical; Length: 4mm; Width: 3mm; Switch Height: 2mm; with Bracket: Without Bracket; Contact Current: 50mA; Voltage Rating: 12V; Actuator/Cap Color: Black; Termination Style: SMD(SMT) Tab; Life: 100,000 Cycles; Operating Temperature: -30℃~+80℃
SW5 = SK12D07VG4_C22435621: Circuit:SPDT Actuator Style:Rectangular column Termination Style:PCPin Length:8.7mm; Supplier Part: C22435621; Manufacturer: HanElectricity(瀚源); Supplier Footprint: 插件-5P,8.7x4.4mm; JLCPCB Part Class: Extended Part; Datasheet: https://item.szlcsc.com/datasheet/SK12D07VG4/24065895.html; Supplier: LCSC; Circuit: SPDT; Actuator Style: Rectangular column; Termination Style: PCPin; Length: 8.7mm
U4 = ESP32-S3-WROOM-1-N16R8: LCSC Part Name: 通用型Wi-Fi+低功耗蓝牙MCU模组; Supplier Part: C2913202; Manufacturer: ESPRESSIF(乐鑫); Supplier Footprint: SMD,25.5x18mm; JLCPCB Part Class: Extended Part; Datasheet: https://item.szlcsc.com/datasheet/ESP32-S3-WROOM-1-N16R8/3198300.html; Supplier: LCSC
U8 = TPS63021DSJR: Function:Buck-Boost Voltage - Supply:1.8V~5.5V Voltage - Supply:1.8V~5.5V Output Voltage:3.3V Output Voltage:3.3V Output Current:- Frequency - Switching:2.4MHz Frequency - Switching:2.4MHz Operating Temperature:-40℃~+85℃@(TA) Operating Temperature:-40℃~+8; LCSC Part Name: 高效单电感升降压转换器; Supplier Part: C202140; Manufacturer: TI(德州仪器); Supplier Footprint: VSON-14-EP(3x4); JLCPCB Part Class: Extended Part; Datasheet: https://www.ti.com/cn/lit/gpn/tps63021; Supplier: LCSC; Function: Buck-Boost; Voltage - Supply: 1.8V~5.5V; Output Voltage: 3.3V; Frequency - Switching: 2.4MHz; Operating Temperature: -40℃~+85℃@(TA); Synchronous Rectifier: Yes; Number of Outputs: 1; Topology: Buck-Boost; Switch tube (built-in/external): Built-in; Output Type: Fixed
U9 = FTC303020D1R5MBCA: Inductance:1.5uH Tolerance:±20% Tolerance:±20% Current Rating:6.3A Current - Saturation(Isat):7A DC Resistance(DCR):19mΩ Type:-; LCSC Part Name: 1.5uH ±20% 7A; Supplier Part: C7423317; Manufacturer: cjiang(长江微电); Supplier Footprint: SMD,3x3mm; JLCPCB Part Class: Extended Part; Datasheet: https://atta.szlcsc.com/upload/public/pdf/source/20240918/5AD8A1A0D9C2859F32750FF2CC514AFA.pdf; Supplier: LCSC; Tolerance: ±20%; Current Rating: 6.3A; Current - Saturation(Isat): 7A; DC Resistance(DCR): 19mΩ
USB1 USB2 = TYPE-C 16PIN 2MD(073): Connector Type:Type-C Protocol Standard:- Gender:Female Mounting Type:Surface Mount, Right Angle Number of Contacts:16P Number of Ports:1 Current Rating-Power:3A Voltage Rating:5V Connect-Disconnect Life:5,000 Cycles Supplementary Features:- Center Height; LCSC Part Name: Type-C 母 卧贴; Supplier Part: C2765186; Manufacturer: SHOU HAN(首韩); Supplier Footprint: SMD; JLCPCB Part Class: Extended Part; Datasheet: https://item.szlcsc.com/datasheet/TYPE-C%252016PIN%25202MD(073)/2901843.html; Supplier: LCSC; Connector Type: Type-C; Gender: Female; Mounting Type: Surface Mount, Right Angle; Number of Contacts: 16P; Number of Ports: 1; Current Rating-Power: 3A; Voltage Rating: 5V; Connect-Disconnect Life: 5,000 Cycles; Detection color: Black; Operating Temperature: -25℃~+85℃
C23 = CL05A475MP5NRNC: Capacitance:4.7uF Tolerance:±20% Tolerance:±20% Voltage Rating:10V Temperature Coefficient:X5R; LCSC Part Name: 4.7uF ±20% 10V; Supplier Part: C23733; Manufacturer: SAMSUNG(三星); Supplier Footprint: 0402; JLCPCB Part Class: Basic Part; Datasheet: https://item.szlcsc.com/datasheet/CL05A475MP5NRNC/24469.html; Supplier: LCSC; Tolerance: ±20%; Voltage Rating: 10V; Temperature Coefficient: X5R
U6 = L80RE-M37: Voltage - Supply:3V~4.3V Voltage - Supply:3V~4.3V Sensitivity:-165dBm Sensitivity:-165dBm Operating Temperature:-40℃~+85℃ Operating Temperature:-40℃~+85℃; LCSC Part Name: GPS模块; Supplier Part: C3029061; Manufacturer: Quectel(移远); Supplier Footprint: SMD-12P; JLCPCB Part Class: Extended Part; Datasheet: https://item.szlcsc.com/datasheet/L80RE-M37/3559900.html; Supplier: LCSC; Voltage - Supply: 3V~4.3V; Sensitivity: -165dBm; Operating Temperature: -40℃~+85℃
BT1 BT2 = BH-18650-A1AJ006: Connector Type:Battery Holder Battery Type:- Contact Plating:Nickel Operating Temperature:-10℃~+100℃ Operating Temperature:-10℃~+100℃; LCSC Part Name: 电池盒; Supplier Part: C5290175; Manufacturer: MYOUNG(美阳); JLCPCB Part Class: Extended Part; Datasheet: https://item.szlcsc.com/datasheet/BH-18650-A1AJ006/6030881.html; Supplier: LCSC; Connector Type: Battery Holder; Contact Plating: Nickel; Operating Temperature: -10℃~+100℃
C6 C7 = CL10A225KO8NNNC: Capacitance:2.2uF Tolerance:±10% Tolerance:±10% Voltage Rating:16V Temperature Coefficient:X5R; LCSC Part Name: 2.2uF ±10% 16V; Supplier Part: C23630; Manufacturer: SAMSUNG(三星); Supplier Footprint: 0603; JLCPCB Part Class: Basic Part; Datasheet: https://item.szlcsc.com/datasheet/CL10A225KO8NNNC/24366.html; Supplier: LCSC; Tolerance: ±10%; Voltage Rating: 16V; Temperature Coefficient: X5R
C24 C25 = CL10C150JB8NNNC: Capacitance:15pF Tolerance:±5% Tolerance:±5% Voltage Rating:50V Temperature Coefficient:C0G; LCSC Part Name: 15pF ±5% 50V; Supplier Part: C1644; Manufacturer: SAMSUNG(三星); Supplier Footprint: 0603; JLCPCB Part Class: Basic Part; Datasheet: https://item.szlcsc.com/datasheet/CL10C150JB8NNNC/1996.html; Supplier: LCSC; Tolerance: ±5%; Voltage Rating: 50V; Temperature Coefficient: C0G
H2 = PZ254V-11-05P: Pin Structure:1x5P Pitch:2.54mm Row Spacing:- Circluar Pins/Square Pins:Pin Header Mounting Type:Through Hole Number of Rows:1 Number of Pins:5P Current Rating:- Voltage Rating (Max):- Length of Mating Pin:6mm Insulation Height:2.5mm Length of End Connect; LCSC Part Name: 1x5P 间距:2.54mm 方针 直插; Supplier Part: C492404; Manufacturer: XFCN(兴飞); Supplier Footprint: 插件,P=2.54mm; JLCPCB Part Class: Extended Part; Datasheet: https://item.szlcsc.com/datasheet/PZ254V-11-05P/502960.html; Supplier: LCSC; Pin Structure: 1x5P; Pitch: 2.54mm; Circluar Pins/Square Pins: Pin Header; Mounting Type: Through Hole; Number of Rows: 1; Number of Pins: 5P; Length of Mating Pin: 6mm; Insulation Height: 2.5mm; Length of End Connection Pin: 3mm; Contact Material: Brass; Operating Temperature: -40℃~+105℃; Color: Black
L4 = DFE252010F-2R2M=P2: Inductance:2.2uH Tolerance:±20% Tolerance:±20% Current Rating:2.3A Current - Saturation(Isat):3.1A DC Resistance(DCR):97mΩ Ratings:-; LCSC Part Name: 2.2uH ±20% 3.1A; Supplier Part: C488330; Manufacturer: muRata(村田); Supplier Footprint: 1008; JLCPCB Part Class: Extended Part; Datasheet: https://item.szlcsc.com/datasheet/DFE252010F-2R2M%253DP2/497930.html; Supplier: LCSC; Tolerance: ±20%; Current Rating: 2.3A; Current - Saturation(Isat): 3.1A; DC Resistance(DCR): 97mΩ
R19 = 0603WAF1001T5E: Type:Thick Film Resistor Resistance:1kΩ Tolerance:±1% Tolerance:±1% Power(Watts):100mW Voltage-Supply(Max):75V Temperature Coefficient:±100ppm/℃ Temperature Coefficient:±100ppm/℃ Operating Temperature:-55℃~+155℃ Operating Temperature:-55℃~+155℃; LCSC Part Name: 1kΩ ±1% 100mW 厚膜电阻; Supplier Part: C21190; Manufacturer: UNI-ROYAL(厚声); Supplier Footprint: 0603; JLCPCB Part Class: Basic Part; Datasheet: https://item.szlcsc.com/datasheet/0603WAF1001T5E/21904.html; Supplier: LCSC; Type: Thick Film Resistor; Tolerance: ±1%; Power(Watts): 100mW; Voltage-Supply(Max): 75V; Temperature Coefficient: ±100ppm/℃; Operating Temperature: -55℃~+155℃
R38 = 0603WAF3652T5E: Type:Thick Film Resistor Resistance:36.5kΩ Tolerance:±1% Tolerance:±1% Power(Watts):100mW Voltage-Supply(Max):75V Temperature Coefficient:±100ppm/℃ Temperature Coefficient:±100ppm/℃ Operating Temperature:-55℃~+155℃ Operating Temperature:-55℃~+155℃; LCSC Part Name: 36.5kΩ ±1% 100mW 厚膜电阻; Supplier Part: C23029; Manufacturer: UNI-ROYAL(厚声); Supplier Footprint: 0603; JLCPCB Part Class: Extended Part; Datasheet: https://item.szlcsc.com/datasheet/0603WAF3652T5E/23756.html; Supplier: LCSC; Type: Thick Film Resistor; Tolerance: ±1%; Power(Watts): 100mW; Voltage-Supply(Max): 75V; Temperature Coefficient: ±100ppm/℃; Operating Temperature: -55℃~+155℃
U3 = STM32U575VGT6: LCSC Part Name: 超低功耗带 FPU 的 Arm Cortex-M33 具有 Trust Zone，160 MHz MCU 带 1MB 闪存; Supplier Part: C5270988; Manufacturer: ST(意法半导体); Supplier Footprint: LQFP-100(14x14); JLCPCB Part Class: Extended Part; Datasheet: https://atta.szlcsc.com/upload/public/pdf/source/20250311/118E46867C2F8A0EF1AEA9206C957AC0.pdf; Supplier: LCSC
U7 = ABM8-272-T3_C20625731: Supplier Part: C20625731; Manufacturer: ABRACON; Supplier Footprint: SMD3225-4P; JLCPCB Part Class: Extended Part; Datasheet: https://item.szlcsc.com/datasheet/ABM8-272-T3/22032038.html; Supplier: LCSC
U11 = TPS63900DSKR: Input Voltage:1.8V~5.5V Input Voltage:1.8V~5.5V Output Current:400mA Switching Frequency:- Switching Frequency:- Operating Temperature:-40℃~+125℃@(TJ) Operating Temperature:-40℃~+125℃@(TJ) Synchronous Rectification:Yes Number of Outputs:- Topology:Step-do; LCSC Part Name: 1.8V至5.5V,75nA超低静态电流同步升降压转换器; Supplier Part: C1518762; Manufacturer: TI(德州仪器); Supplier Footprint: WSON-10-EP(2.5x2.5); JLCPCB Part Class: Extended Part; Datasheet: https://www.ti.com/cn/lit/gpn/tps63900; Supplier: LCSC; Input Voltage: 1.8V~5.5V; Output Current: 400mA; Operating Temperature: -40℃~+125℃@(TJ); Synchronous Rectification: Yes; Topology: Step-down-Boost
C58 = CL05A225MQ5NSNC: Capacitance:2.2uF Tolerance:±20% Tolerance:±20% Voltage Rating:6.3V Temperature Coefficient:X5R; LCSC Part Name: 2.2uF ±20% 6.3V; Supplier Part: C12530; Manufacturer: SAMSUNG(三星); Supplier Footprint: 0402; JLCPCB Part Class: Basic Part; Datasheet: https://item.szlcsc.com/datasheet/CL05A225MQ5NSNC/13164.html; Supplier: LCSC; Tolerance: ±20%; Voltage Rating: 6.3V; Temperature Coefficient: X5R
CARD1 = TF PUSH: Card Connection Mode:Push-Push Card Type:MicroSD Card (TF Card) Connector Type:Connector and Ejector Additional Card Detection Pins:No Supplementary Features:- Height Above Board:2mm Operating Temperature:-25℃~+90℃ Operating Temperature:-25℃~+90℃; LCSC Part Name: 自弹式 MicroSD卡(TF卡) 卡座; Supplier Part: C393941; Manufacturer: SHOU HAN(首韩); Supplier Footprint: SMD; JLCPCB Part Class: Extended Part; Datasheet: https://item.szlcsc.com/datasheet/TF%2520PUSH/372553.html; Supplier: LCSC; Card Connection Mode: Push-Push; Card Type: MicroSD Card (TF Card); Connector Type: Connector and Ejector; Additional Card Detection Pins: No; Height Above Board: 2mm; Operating Temperature: -25℃~+90℃
R37 = 0402WGF330JTCE: Type:Thick Film Resistor Resistance:33Ω Tolerance:±1% Tolerance:±1% Power(Watts):62.5mW Voltage-Supply(Max):50V Temperature Coefficient:±100ppm/℃ Temperature Coefficient:±100ppm/℃ Operating Temperature:-55℃~+155℃ Operating Temperature:-55℃~+155℃; LCSC Part Name: 33Ω ±1% 62.5mW 厚膜电阻; Supplier Part: C25105; Manufacturer: UNI-ROYAL(厚声); Supplier Footprint: 0402; JLCPCB Part Class: Basic Part; Datasheet: https://item.szlcsc.com/datasheet/0402WGF330JTCE/25848.html; Supplier: LCSC; Type: Thick Film Resistor; Tolerance: ±1%; Power(Watts): 62.5mW; Voltage-Supply(Max): 50V; Temperature Coefficient: ±100ppm/℃; Operating Temperature: -55℃~+155℃
R43 = RE2512F3R020: Type:Current Sense Resistor；Alloy Resistor Resistance:20mΩ Tolerance:±1% Tolerance:±1% Power(Watts):3W Temperature Coefficient:±50ppm/℃ Temperature Coefficient:±50ppm/℃; LCSC Part Name: 20mΩ 3W 2512 ±1%; Supplier Part: C46961755; Manufacturer: JIERR(捷而瑞); Supplier Footprint: 2512; JLCPCB Part Class: Extended Part; Datasheet: https://item.szlcsc.com/datasheet/RE2512F3R020/49133294.html; Supplier: LCSC; Type: Current Sense Resistor；Alloy Resistor; Tolerance: ±1%; Power(Watts): 3W; Temperature Coefficient: ±50ppm/℃
U10 = INA226AIDGSR: Number of Channels:- Vcm - Common Mode Voltage:300mV~40V Vcm - Common Mode Voltage:300mV~40V Gain:- Bandwidth:- Ib - Input Bias Current:10nA Vos - Input Offset Voltage:2.5uV Operating Temperature:-40℃~+125℃ Operating Temperature:-40℃~+125℃ Differential Vo; Supplier Part: C49851; Manufacturer: TI(德州仪器); Supplier Footprint: MSOP-10; JLCPCB Part Class: Extended Part; Datasheet: https://item.szlcsc.com/datasheet/INA226AIDGSR/50860.html; Supplier: LCSC; Vcm - Common Mode Voltage: 300mV~40V; Ib - Input Bias Current: 10nA; Vos - Input Offset Voltage: 2.5uV; Operating Temperature: -40℃~+125℃; Differential Voltage: -40V~+40V; Single Supply: 2.7V~5.5V; Quiescent Current: 330uA; Input Offset Voltage Drift(Vos TC): 0.1uV/℃; Common Mode Rejection Ratio (CMRR): 140dB
U12 = ICM-42688-PC: Accelerometer Sensing Axis:X,Y,Z Acceleration Measurement Range (MAX):±16g Acceleration Measurement Range (MAX):±16g Gyroscope Sensing Axis:X,Y,Z Gyroscope Measurement Range (MAX):±2048dps Gyroscope Measurement Range (MAX):±2048dps Sensor Type:IMU Output; LCSC Part Name: 低噪声、宽带宽6D惯性测量单元，带运动协处理器; Supplier Part: C48586483; Manufacturer: Tokmas(托克马斯); Supplier Footprint: LGA-14(2.5x3); JLCPCB Part Class: Extended Part; Datasheet: https://item.szlcsc.com/datasheet/ICM-42688-PC/50854565.html; Supplier: LCSC; Accelerometer Sensing Axis: X,Y,Z; Acceleration Measurement Range (MAX): ±16g; Gyroscope Sensing Axis: X,Y,Z; Gyroscope Measurement Range (MAX): ±2048dps; Sensor Type: IMU; Output Bits: 16bit; Interface: I3C；I2C；SPI; Voltage - Supply: 1.71V~3.6V; Cache Size: 1.5KB; Operating Temperature: -40℃~+85℃
U13 = BMM150: LCSC Part Name: 三轴地磁式传感器 停产; Supplier Part: C171681; Manufacturer: Bosch(博世); Supplier Footprint: WLCSP-12(1.6x1.6); JLCPCB Part Class: Extended Part; Datasheet: https://item.szlcsc.com/datasheet/BMM150/183067.html; Supplier: LCSC
U16 = 2541WR-08P: Pin Structure:1x8P Pitch:2.54mm Circluar Pins/Square Pins:Pin Header Mounting Type:Right Angle Number of Rows:1 Number of Pins:8P Current Rating:3A Length of Mating Pin:6mm Insulation Height:2.54mm Contact Material:Brass Contact Plating:Gold Operating Tem; LCSC Part Name: 1x8P 间距:2.54mm 方针 弯插; Supplier Part: C5383100; Manufacturer: HanElectricity(瀚源); Supplier Footprint: 弯插,P=2.54mm; JLCPCB Part Class: Extended Part; Datasheet: https://item.szlcsc.com/datasheet/2541WR-08P/6258460.html; Supplier: LCSC; Pin Structure: 1x8P; Pitch: 2.54mm; Circluar Pins/Square Pins: Pin Header; Mounting Type: Right Angle; Number of Rows: 1; Number of Pins: 8P; Current Rating: 3A; Length of Mating Pin: 6mm; Insulation Height: 2.54mm; Contact Material: Brass; Contact Plating: Gold; Operating Temperature: -40℃~+105℃; Color: Black
U17 U19 = KF350R-3.5-2P: Number of Positions or Pins:1x2P Pitch:3.5mm Color:Green Mounting Type:Right Angle Number of Pins:2P Number of Rows:1 Number of PINs Per Row:2 Current Rating:10A Voltage Rating (Max):300V Wire Gauge - AWG:18~24 Wire Gauge - mm2:0.75 Wire Gauge - mm2:0.75; LCSC Part Name: 1x2P 3.5mm 弯插 排数:1 每排P数:2; Supplier Part: C474896; Manufacturer: KEFA(科发); Supplier Footprint: 弯插,P=3.5mm; JLCPCB Part Class: Extended Part; Datasheet: https://item.szlcsc.com/datasheet/KF350R-3.5-2P/481514.html; Supplier: LCSC; Number of Positions or Pins: 1x2P; Pitch: 3.5mm; Color: Green; Mounting Type: Right Angle; Number of Pins: 2P; Number of Rows: 1; Number of PINs Per Row: 2; Current Rating: 10A; Voltage Rating (Max): 300V; Wire Gauge - AWG: 18~24; Wire Gauge - mm2: 0.75; Operating Temperature: -40℃~+105℃
U18 = KF350R-3.5-3P: Number of Positions or Pins:1x3P Pitch:3.5mm Color:Green Mounting Type:Right Angle Number of Pins:3P Number of Rows:1 Number of PINs Per Row:3 Current Rating:10A Voltage Rating (Max):300V Wire Gauge - AWG:18~24 Wire Gauge - mm2:0.75 Wire Gauge - mm2:0.75; LCSC Part Name: 1x3P 3.5mm 弯插 排数:1 每排P数:3; Supplier Part: C474897; Manufacturer: KEFA(科发); Supplier Footprint: 弯插,P=3.5mm; JLCPCB Part Class: Extended Part; Datasheet: https://item.szlcsc.com/datasheet/KF350R-3.5-3P/481515.html; Supplier: LCSC; Number of Positions or Pins: 1x3P; Pitch: 3.5mm; Color: Green; Mounting Type: Right Angle; Number of Pins: 3P; Number of Rows: 1; Number of PINs Per Row: 3; Current Rating: 10A; Voltage Rating (Max): 300V; Wire Gauge - AWG: 18~24; Wire Gauge - mm2: 0.75; Operating Temperature: -40℃~+105℃

## Nets
3.7V: C15.2 C16.2 C17.2 C18.2 C19.2 C32.2 SW6.1 U1.34(VBAT) U1.35(VBAT)
GND: BT1.1 BT2.1 C2.1 C3.1 C4.1 C5.1 C6.1 C7.1 C8.1 C9.1 C10.1 C11.1 C12.1 C13.1 C14.1 C15.1 C16.1 C17.1 C18.1 C19.1 C20.1 C21.1 C22.1 C23.1 C24.1 C25.1 C26.1 C27.1 C28.1 C29.1 C30.1 C31.1 C32.1 C33.1 C34.1 C35.1 C36.1 C37.1 C38.1 C39.1 C40.1 C41.1 C43.1 C44.1 C45.1 C46.1 C49.1 C51.1 C52.2 C53.2 C54.1 C55.1 C56.1 C57.1 C58.1 C59.1 C60.1 CARD1.6(VSS) CARD1.10 CARD1.11 CARD1.12 CARD1.13 D1.2 H2.2 JP1.3 JP1.19 JP1.20 JP2.3 JP2.19 JP2.20 JP3.18 JP3.19 JP3.20 L1.2(GND) L2.2 L5.1 L6.1 LED4.2(K) LED5.2(K) Q1.2(S) Q2.2(S) Q3.2(S) R6.1 R7.1 R8.1 R9.1 R11.1 R14.1 R17.1 R25.1 R26.1 R30.1 R38.1 SW1.2 SW2.2 SW4.2 U1.8(GND) U1.13(GND) U1.19(GND) U1.21(GND) U1.27(GND) U1.30(GND) U1.31(GND) U1.33(GND) U1.36(GND) U1.37(GND) U1.45(GND) U1.63(GND) U1.66(GND) U1.67(GND) U1.69(GND) U1.70(GND) U1.71(GND) U1.72(GND) U1.73(GND) U1.74(GND) U1.75(GND) U1.76(GND) U1.77(GND) U2.5(GND) U2.8(GND) U2.9(GND) U2.10(GND) U2.11(GND) U3.10(VSS) U3.19(VSSA) U3.20(VREF-) U3.27(VSS) U3.49(VSS) U3.74(VSS) U3.99(VSS) U4.1(GND) U4.40(GND) U4.41(GND) U5.11(GND) U5.21(EP) U6.3(GND) U6.12(GND) U7.2(GND) U7.4(GND) U8.2(GND) U8.13(PS/SYNC) U8.15(PGND) U10.7(GND) U11.4(CFG2) U11.5(CFG3) U11.8(GND) U11.11(EP) U12.6(GND) U12.7(GND) U13.A1(PS) U13.C5(GND) U13.E1(GND) U13.E3(GND) U16.7 U17.2 U18.3 USB1.1(GND) USB1.12(GND) USB2.1(GND) USB2.12(GND)
VBAT: C20.2 C23.2 C26.2 C27.2 C34.2 C45.2 D1.5 R43.1 SW5.3 SW6.2 U6.5(V_BCKP) U8.10(VIN) U8.11(VIN) U10.8(VBUS) U10.9(VIN-) U11.1(EN) U11.2(SEL) U11.10(VIN)
VBAT_IN: BT1.2 BT2.2 R43.2 U10.10(VIN+)
VINA: C31.2 U8.1(VINA)
BMM150_PWR: C59.2 C60.2 U3.29(PA4) U13.B2(VDDIO) U13.E5(VDD)
CEL_ANT: C1.2 C2.2 L1.3(FEED) L2.1
CEL_SIGNAL: C1.1 U1.32(RF_ANT)
CEL_STATUS: R14.2 R16.2 U1.42(STATUS) U4.8(IO15)
CHIP_PU: C39.2 C40.2 R29.2 SW1.1 U4.3(EN)
E-INK_POWER: U3.30(PA5) U16.8
ESP32_CS: U3.33(PC4) U4.10(IO17)
ESP_3.3V: C5.2 C21.2 C22.2 C28.2 C29.2 C30.2 C33.2 C35.2 C36.2 C37.2 C55.2 C56.2 CARD1.4(VDD) JP1.1 JP2.1 JP3.1 R12.2 R15.2 R20.2 R29.1 R31.2 R32.2 R33.2 R34.2 R35.2 R36.2 R41.1 U4.2(3V3) U5.19(VCCB) U6.4(VCC) U8.3(FB) U8.4(VOUT) U8.5(VOUT)
ESP_5V: USB1.2(VBUS) USB1.11(VBUS)
ESP_CTS: U4.32(IO39) U5.15(B5)
ESP_DCD: U4.31(IO38) U5.16(B4)
ESP_DTR: U4.38(IO2) U5.17(B3)
ESP_L1: U8.8(L1) U8.9(L1) U9.1
ESP_L2: U8.6(L2) U8.7(L2) U9.2
ESP_ON_SWITCH: SW5.2 U8.12(EN)
ESP_POWER_EN: SW5.1 U3.34(PC5)
ESP_RI: U4.39(IO1) U5.18(B2)
ESP_RTS: U4.33(IO40) U5.14(B6)
ESP_RX: H1.1 U4.35(IO42) U5.12(B8)
ESP_STM_RX: U3.68(PA9) U4.36(RXD0)
ESP_STM_TX: U3.69(PA10) U4.37(TXD0)
ESP_TX: H1.2 U4.34(IO41) U5.13(B7)
GPS_RX: U4.4(IO4) U6.1(RXD1)
GPS_TX: U4.5(IO5) U6.2(TXD1)
GSM_CTS: U1.4(UART1_CTS) U5.6(A5)
GSM_DCD: U1.5(UART1_DCD) U5.5(A4)
GSM_DTR: U1.6(UART1_DTR) U5.4(A3)
GSM_RI: U1.7(UART1_RI) U5.3(A2)
GSM_RTS: U1.3(UART1_RTS) U5.7(A6)
GSM_RXD: U1.2(UART1_RXD) U5.8(A7)
GSM_TXD: U1.1(UART1_TXD) U5.9(A8)
ICM_INT1: U3.98(PE1) U12.4(INT1)
ICM_INT2: U3.97(PE0) U12.9(INT2)
IMU_POWER: C54.2 C57.2 C58.2 U3.88(PD7) U12.2(SDx) U12.3(SCx) U12.5(VDDIO) U12.8(VDD) U12.10(RESV)
INK_BUSY: U3.41(PE10) U16.1
INK_DC: U3.43(PE12) U16.3
INK_RST: U3.42(PE11) U16.2
IO0: C41.2 SW2.1 U4.27(IO0)
LCD1_CS: JP1.9 U4.18(IO10)
LCD1_RST: JP1.8 U4.23(IO21)
LCD2_CS: JP2.9 U4.21(IO13)
LCD2_RST: JP2.8 U4.24(IO47)
LCD_BL: JP1.2 JP2.2 U4.9(IO16)
LCD_DC: JP1.7 JP2.7 U4.22(IO14)
LCD_MOSI: JP1.5 JP2.5 U4.19(IO11)
LCD_SCLK: JP1.4 JP2.4 U4.20(IO12)
LP_3.3V: C38.2 R27.2 R28.2 U3.2(PE3) U10.6(VS+)
NETLIGHT: R11.2 R13.2 U1.41(NETLIGHT)
NRST: C46.2 H2.5 R44.1 SW4.1 U3.14(NRST)
OUT_1: U3.37(PB2) U18.1
OUT_2: U3.51(PB12) U18.2
OUT_3: U4.6(IO6) U19.1
OUT_4: U4.15(IO3) U19.2
PB0: U3.35(PB0)
PB1: U3.36(PB1)
PB4: U3.90(PB4)
PB5: U3.91(PB5)
PB8: U3.95(PB8)
PB9: U3.96(PB9)
PB13: JP3.5 U3.60(PD13)
PB14: JP3.6 U3.61(PD14)
PB15: U3.62(PD15)
PD10: JP3.2 U3.57(PD10)
PD11: JP3.3 U3.58(PD11)
PD12: JP3.4 U3.59(PD12)
PE4: U3.3(PE4)
PE5: U3.4(PE5)
PE6: U3.5(PE6)
POWER_GOOD: R20.1 U3.26(PA3) U8.14(PG)
PWRKEY: H1.3 Q3.3(D) U1.39(PWRKEY)
SD_CD: CARD1.CD U3.45(PE14)
SD_CLK: R37.2 U3.80(PC12)
SD_CMD: CARD1.3(CMD) R33.1 U3.83(PD2)
SD_DAT0: CARD1.7(DAT0) R35.1 U3.65(PC8)
SD_DAT1: CARD1.8(DAT1) R36.1 U3.66(PC9)
SD_DAT2: CARD1.1(DAT2) R31.1 U3.78(PC10)
SD_DAT3: CARD1.2(CD/DAT3) R32.1 U3.79(PC11)
SIM_CLK: D1.4 R2.1 U2.3(CLK)
SIM_DATA: D1.1 R3.1 U2.7(I/O)
SIM_EXT: C4.2 U1.40(VDD_EXT) U5.2(VCCA) U5.10(OE)
SIM_RST: D1.6 R1.1 U2.2(RST)
SIM_VDD: C3.2 U1.18(SIM_VDD) U2.1(VCC)
SPEED_SENSE: U3.54(PB15) U3.56(PD9) U4.7(IO7) U17.1
SPI2_CS: U3.81(PD0) U12.12(CS)
SPI2_CS2: U3.86(PD5) U13.A5(CSB)
SPI2_CS3: U3.44(PE13) U16.4
SPI2_MISO: U3.84(PD3) U12.1(SDO/SA0) U13.C1(SDO)
SPI2_MOSI: U3.85(PD4) U12.14(SDA) U13.B4(SDI) U16.6
SPI2_SCK: U3.82(PD1) U12.13(SCL) U13.A3(SCK) U16.5
STM32_5V: USB2.2(VBUS) USB2.11(VBUS)
STM32_BOOT: C42.2 R30.2 SW3.1 U3.94(PH3-BOOTO)
STM32_DN: U3.70(PA11) USB2.5(DN2) USB2.7(DN1)
STM32_DP: U3.71(PA12) USB2.6(DP1) USB2.8(DP2)
STM/ESP32_MISO: U3.31(PA6) U4.12(IO8)
STM/ESP32_MOSI: U3.32(PA7) U4.11(IO18)
STM/ESP32_SCK: JP3.10 U3.24(PA1) U4.17(IO9)
STM_3.3V: C8.2 C9.2 C10.2 C11.2 C12.2 C13.2 C14.2 C42.1 C43.2 C44.2 C49.2 C51.2 C52.1 C53.1 H2.4 R44.2 SW3.2 U3.6(VBAT) U3.11(VDD) U3.21(VREF+) U3.22(VDDA) U3.28(VDD) U3.50(VDD) U3.73(VDDUSB) U3.75(VDD) U3.100(VDD) U11.6(VOUT)
STM_LED1: R42.1 U3.1(PE2)
STM_SCL: R28.1 U3.92(PB6) U10.5(SCL)
STM_SCL2: JP1.13 U3.47(PB10)
STM_SCL3: JP2.13 U3.16(PC1)
STM_SDA: R27.1 U3.89(PB3) U10.4(SDA)
STM_SDA2: JP1.14 U3.53(PB14)
STM_SDA3: JP2.14 U3.15(PC0)
STM_VCAP: C6.2 C7.2 U3.48(VCAP)
SWCLK: H2.3 U3.76(PA14)
SWDIO: H2.1 U3.72(PA13)
TP1_INT: JP1.15 U3.55(PD8)
TP1_RST: JP1.12 U3.46(PE15)
TP2_INT: JP2.15 U3.18(PC3)
TP2_RST: JP2.12 U3.17(PC2)
USB_ESP32_D+: U4.14(IO20) USB1.6(DP1) USB1.8(DP2)
USB_ESP32_D-: U4.13(IO19) USB1.5(DN2) USB1.7(DN1)
XIN: C24.2 U3.12(PH0-OSC_IN) U7.1
XOUT: R19.2 U3.13(PH1-OSC_OUT)
$1N2228: R1.2 U1.17(SIM_RST)
$1N2232: R2.2 U1.16(SIM_CLK)
$1N2268: R3.2 U1.15(SIM_DATA)
$1N8718: Q1.1(G) R13.1
$1N9009: LED1.1(K) Q1.3(D)
$1N9048: LED1.2(A) R12.1
$1N9376: Q2.1(G) R16.1
$1N9379: LED3.2(K) Q2.3(D)
$1N12926: LED3.1(A) R15.1
$2N982: L5.2 USB2.13(SHELL) USB2.14(SHELL)
$2N1148: R9.2 USB2.10(CC2)
$2N1180: R8.2 USB2.4(CC1)
$2N1889: C25.2 R19.1 U7.3
$2N6247: L4.1 U11.9(LX1)
$2N6256: L4.2 U11.7(LX2)
$2N6373: R38.2 U11.3(CFG1)
$2N9807: LED5.1(A) R42.2
$3N447: L6.2 USB1.13(SHELL) USB1.14(SHELL)
$3N469: R6.2 USB1.10(CC2)
$3N471: R7.2 USB1.4(CC1)
$3N580: R17.2 R18.2 U4.25(IO48)
$3N1418: Q3.1(G) R18.1
$3N7147: LED4.1(A) R41.2
$5N1067: CARD1.5(CLX) R34.1 R37.1
$5N1654: R26.2 U10.2(A0)
$5N1655: R25.2 U10.1(A1)

Not connected (* = marked no-connect by the designer): D1 3; JP1 6* 10* 11* 16* 17* 18*; JP2 6* 10* 11* 16* 17* 18*; JP3 7 8 9 11 12 13 14 15 16 17; L1 1(FIXING_PAD1)* 4(FIXING_PAD2)*; SW5 4 5; SW6 3; U1 9(PCM_DIN)* 10(PCM_DOUT)* 11(PCM_CLK)* 12(PCM_SYNC)* 14(GPIO5)* 20(BOOT_CFG)* 22(UART2_TXD)* 23(UART2_RXD)* 24(USB_VBUS)* 25(USB_DP)* 26(USB_DM)* 28(NC)* 29(NC)* 38(ADC)* 43(ANT_CONTROL1)* 44(ANT_CONTROL0)* 46(NC)* 47(NC)* 48(SPI_CS)* 49(*SPI_MOSI)* 50(SPI_CLK)* 51(SPI_MISO)* 52(NC)* 53(NC)* 54(NC)* 55(NC)* 56(NC)* 57(GPIO1)* 58(GPIO2)* 59(GPIO3)* 60(GPIO4)* 61(UART3_TXD)* 62(UART3_RXD)* 64(I2C_SDA)* 65(I2C_SCL)* 68(GNSS_ANT)*; U2 6(VPP)*; U3 7(PC13) 8(PC14-OSC32_IN) 9(PC15-OSC32_OUT) 23(PA0) 25(PA2) 38(PE7) 39(PE8) 40(PE9) 52(PB13) 63(PC6) 64(PC7) 67(PA8) 77(PA15) 87(PD6) 93(PB7); U4 16(IO46)* 26(IO45)* 28(IO35)* 29(IO36)* 30(IO37)*; U5 1(A1) 20(B1); U6 6(1PPS) 7(RESERVED)* 8(RESERVED)* 9(NC)* 10(RESET) 11(RESERVED)*; U10 3(Alert)*; U12 11(RESV-NC)*; U13 D2(INT)* D4(DRY)*; USB1 3(SBU2)* 9(SBU1)*; USB2 3(SBU2)* 9(SBU1)*

## Notes on the sheets
sheet 1
- ANTENNA
- ANTENNA MATCHING
- SIM Card
- Voltage Level Shifting
sheet 2
- Battery
- Buttons
- STM_RX
- Buck-Boost
- STM_TX
- USB-C
- Crystal
sheet 3
- Buttons
sheet 5
- INA226
- ACCEL & GYRO
- COMPASS
